# Altium project foxbms2-master.PrjPcb (part 3 of 7)

## Sheet mcu-com-gpio-tim.SchDoc
size A3; DocumentNumber: 24; SheetNumber: 24; SheetTotal: 45; SheetDescription: MCU COM, GPIO and TIM
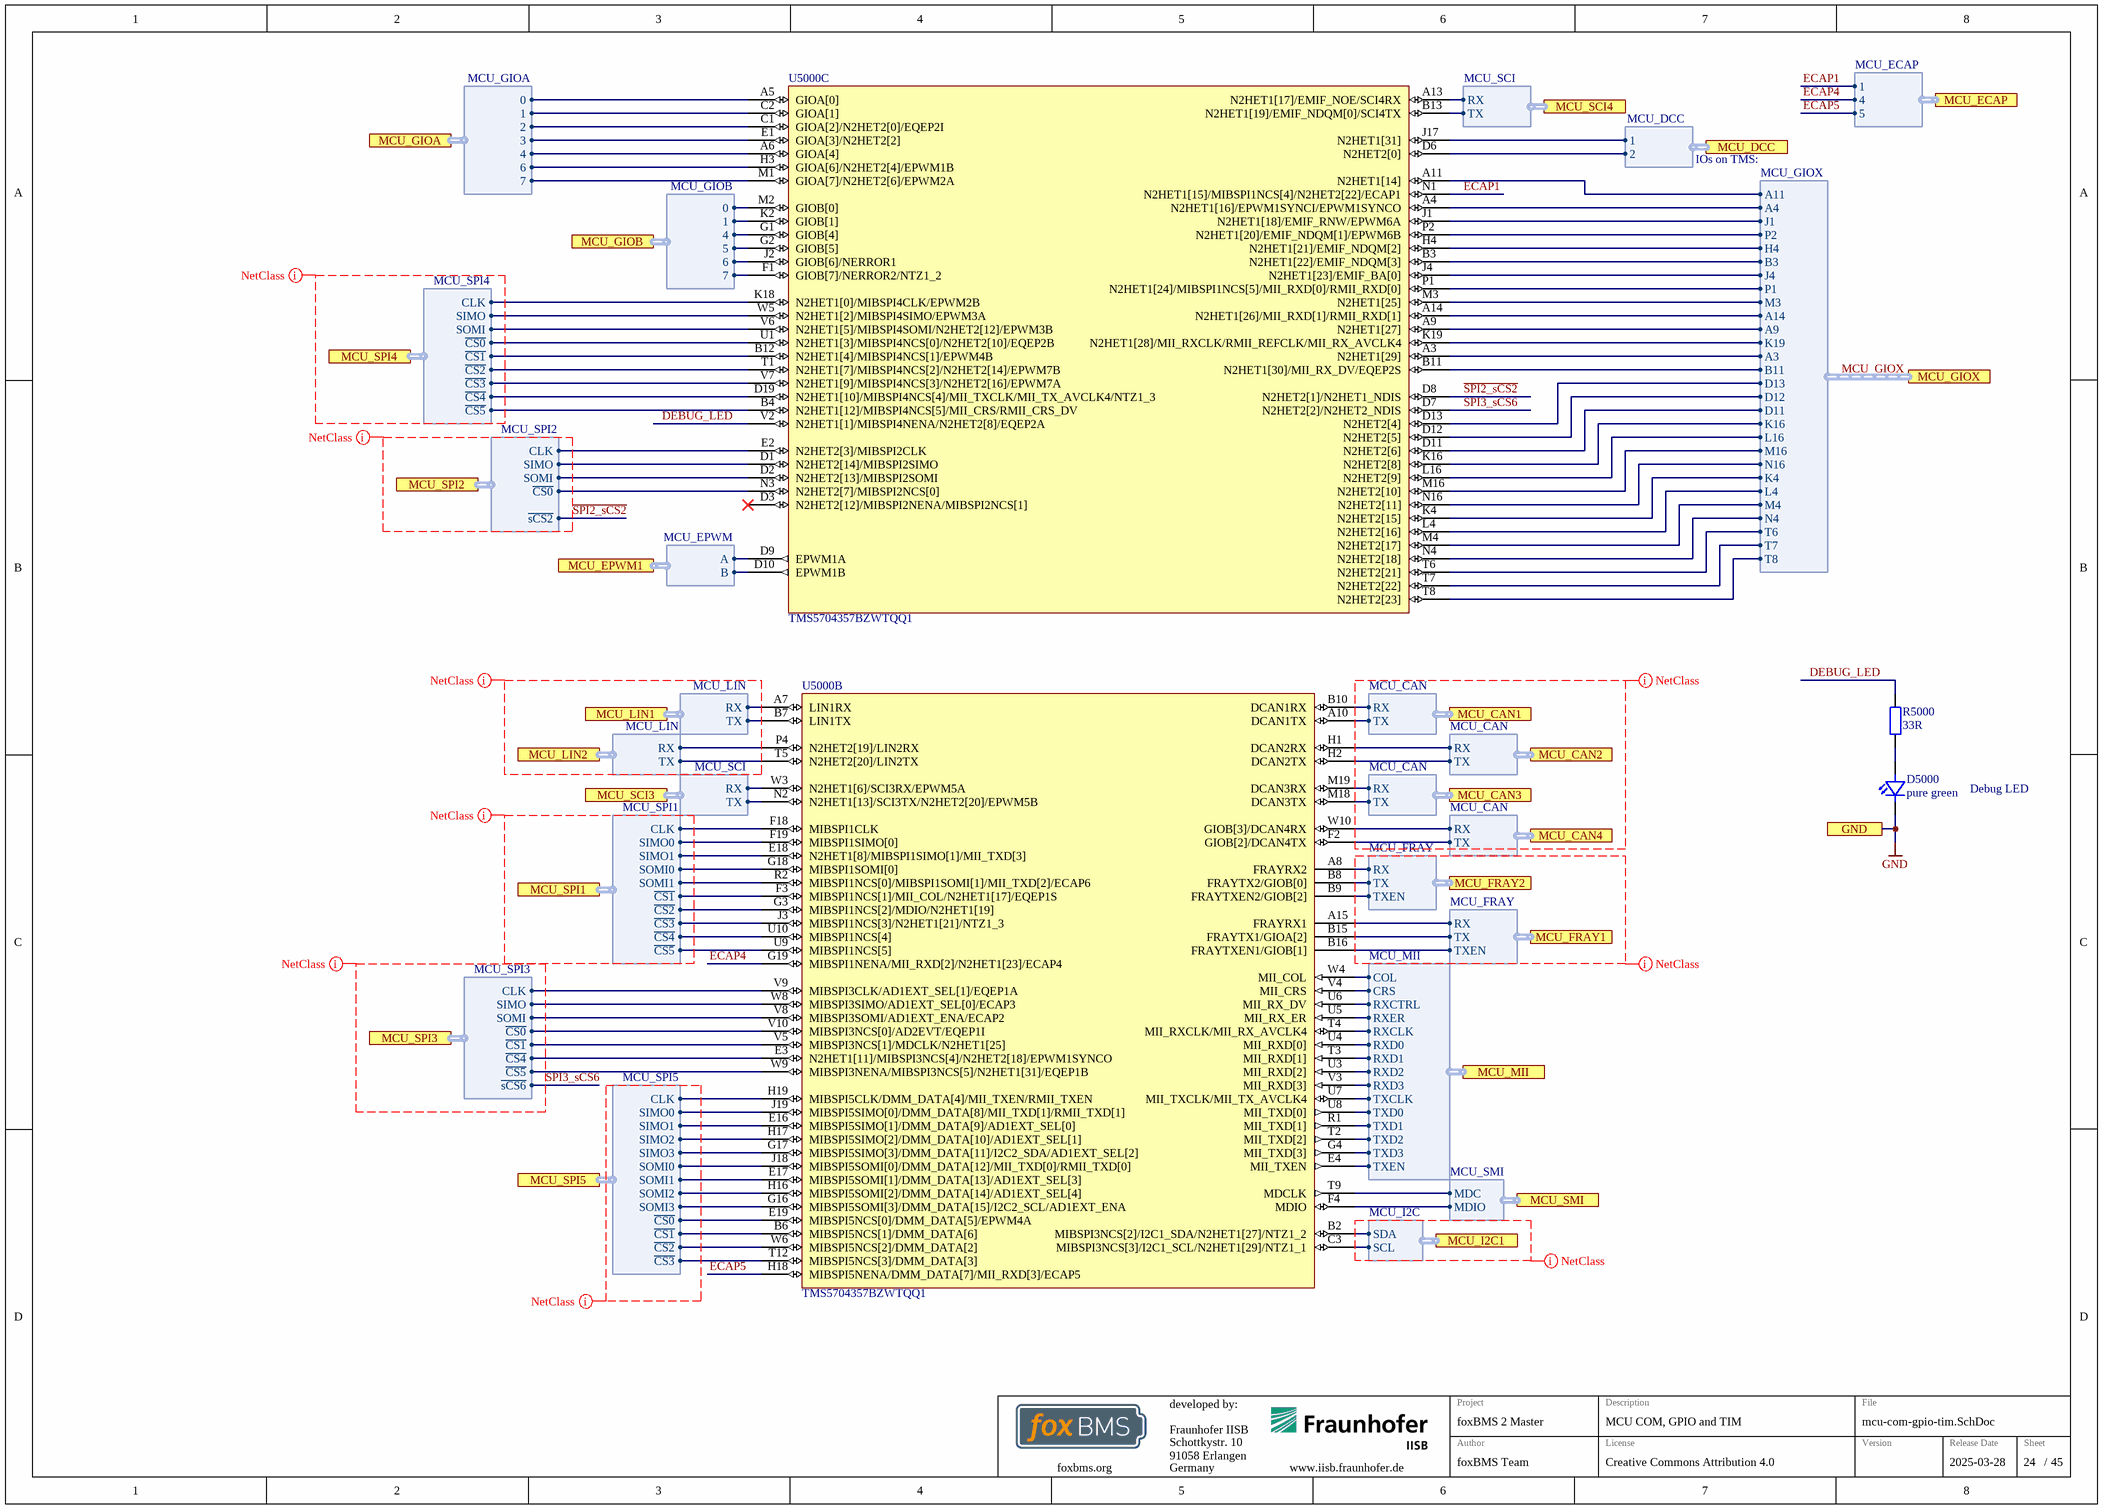
[diagram p7: mcu-com-gpio-tim.SchDoc]

### Parts
D5000  pure green  [LEDC1608X07N]
R5000  33R  [RESC1005X04N]
U5000  TMS5704357BZWTQQ1  [BGA337C80P19X19_1600X1600X140]  (parts B,C of 6)

### Ports
GND, MCU_CAN1 (harness MCU_CAN), MCU_CAN2 (harness MCU_CAN), MCU_CAN3 (harness MCU_CAN), MCU_CAN4 (harness MCU_CAN), MCU_DCC (harness MCU_DCC), MCU_ECAP (harness MCU_ECAP), MCU_EPWM1 (harness MCU_EPWM), MCU_FRAY1 (harness MCU_FRAY), MCU_FRAY2 (harness MCU_FRAY), MCU_GIOA (harness MCU_GIOA), MCU_GIOB (harness MCU_GIOB), MCU_GIOX (harness MCU_GIOX), MCU_I2C1 (harness MCU_I2C), MCU_LIN1 (harness MCU_LIN), MCU_LIN2 (harness MCU_LIN), MCU_MII (harness MCU_MII), MCU_SCI3 (harness MCU_SCI), MCU_SCI4 (harness MCU_SCI), MCU_SMI (harness MCU_SMI), MCU_SPI1 (harness MCU_SPI1), MCU_SPI2 (harness MCU_SPI2), MCU_SPI3 (harness MCU_SPI3), MCU_SPI4 (harness MCU_SPI4), MCU_SPI5 (harness MCU_SPI5)

### Harnesses
MCU_CAN: RX, TX
MCU_FRAY: RX, TX, TXEN
MCU_SMI: MDC, MDIO
MCU_MII: TXD0, TXD1, TXD2, TXD3, TXEN, TXCLK, RXCTRL, RXCLK, RXD3, RXD2, RXD0, RXD1, RXER, COL, CRS
MCU_LIN: RX, TX
MCU_SPI1: CLK, SIMO0, SOMI0, SOMI1, ~{CS1}, ~{CS2}, ~{CS3}, ~{CS4}, ~{CS5}, SIMO1
MCU_SPI3: CLK, SIMO, SOMI, ~{CS1}, ~{CS4}, ~{CS5}, ~{CS0}, ~{sCS6}
MCU_SPI5: CLK, SIMO0, SOMI0, SOMI1, ~{CS1}, ~{CS2}, ~{CS3}, ~{CS0}, SIMO1, SIMO2, SIMO3, SOMI2, SOMI3
MCU_SCI: RX, TX
MCU_I2C: SDA, SCL
MCU_SPI4: CLK, SIMO, SOMI, ~{CS1}, ~{CS2}, ~{CS3}, ~{CS0}, ~{CS4}, ~{CS5}
MCU_SPI2: CLK, SIMO, SOMI, ~{CS0}, ~{sCS2}
MCU_EPWM: A, B
MCU_GIOA: 0, 2, 3, 4, 6, 7, 1
MCU_GIOB: 0, 1, 4, 5, 6, 7
MCU_DCC: 1, 2
MCU_ECAP: 1, 4, 5
MCU_GIOX: A11, A4, J1, P2, H4, B3, J4, P1, M3, A14, A9, K19, A3, B11, D13, D12, D11, K16, L16, M16, N16, K4, L4, M4, T6, T7, N4, T8

### Nets
GND: D5000.1(C) ; port GND
~{SPI2_sCS2}: U5000.D8(N2HET2[1]/N2HET1_NDIS) ; port MCU_SPI2.~{sCS2}  [project net MCU_SPI2~{.}sCS2]
~{SPI3_sCS6}: U5000.D7(N2HET2[2]/N2HET2_NDIS) ; port MCU_SPI3.~{sCS6}  [project net MCU_SPI3~{.}sCS6]
CAN1-CTRL~{.}STB: U5000.T8(N2HET2[23]) ; port MCU_GIOX.T8
CAN1-CTRL.EN: U5000.N4(N2HET2[18]) ; port MCU_GIOX.N4
COM_IO~{.}ETH_INT: U5000.J2(GIOB[6]/NERROR1) ; port MCU_GIOB.6
COM_IO~{.}ETH_RESET: U5000.C2(GIOA[1]) ; port MCU_GIOA.1
COM_IO.CAN_FAULT: U5000.G2(GIOB[5]) ; port MCU_GIOB.5
DEBUG_LED: R5000.2 U5000.V2(N2HET1[1]/MIBSPI4NENA/N2HET2[8]/EQEP2A)  [project net DEBUG_LED_24]
ECAP1: U5000.N1(N2HET1[15]/MIBSPI1NCS[4]/N2HET2[22]/ECAP1) ; port MCU_ECAP.1  [project net IODEV_IO.IM_PWM]
ECAP4: U5000.G19(MIBSPI1NENA/MII_RXD[2]/N2HET1[23]/ECAP4) ; port MCU_ECAP.4  [project net EXT_CON.ECAP4]
ECAP5: U5000.H18(MIBSPI5NENA/DMM_DATA[7]/MII_RXD[3]/ECAP5) ; port MCU_ECAP.5  [project net EXT_CON.ECAP5]
EXT_CON.DCC1: U5000.J17(N2HET1[31]) ; port MCU_DCC.1
EXT_CON.EPWM1A: U5000.D9(EPWM1A) ; port MCU_EPWM1.A
EXT_CON.EPWM1B: U5000.D10(EPWM1B) ; port MCU_EPWM1.B
EXT_CON.IL_STATE: U5000.A3(N2HET1[29]) ; port MCU_GIOX.A3
EXT_CON.MCU_A4: U5000.A4(N2HET1[16]/EPWM1SYNCI/EPWM1SYNCO) ; port MCU_GIOX.A4
EXT_CON.MCU_A11: U5000.A11(N2HET1[14]) ; port MCU_GIOX.A11
EXT_CON.MCU_A14: U5000.A14(N2HET1[26]/MII_RXD[1]/RMII_RXD[1]) ; port MCU_GIOX.A14
EXT_CON.MCU_B3: U5000.B3(N2HET1[22]/EMIF_NDQM[3]) ; port MCU_GIOX.B3
EXT_CON.MCU_GIOA7: U5000.M1(GIOA[7]/N2HET2[6]/EPWM2A) ; port MCU_GIOA.7
EXT_CON.MCU_H4: U5000.H4(N2HET1[21]/EMIF_NDQM[2]) ; port MCU_GIOX.H4
EXT_CON.MCU_J1: U5000.J1(N2HET1[18]/EMIF_RNW/EPWM6A) ; port MCU_GIOX.J1
EXT_CON.MCU_J4: U5000.J4(N2HET1[23]/EMIF_BA[0]) ; port MCU_GIOX.J4
EXT_CON.MCU_K19: U5000.K19(N2HET1[28]/MII_RXCLK/RMII_REFCLK/MII_RX_AVCLK4) ; port MCU_GIOX.K19
EXT_CON.MCU_M16: U5000.M16(N2HET2[10]) ; port MCU_GIOX.M16
EXT_CON.MCU_N16: U5000.N16(N2HET2[11]) ; port MCU_GIOX.N16
EXT_CON.MCU_P1: U5000.P1(N2HET1[24]/MIBSPI1NCS[5]/MII_RXD[0]/RMII_RXD[0]) ; port MCU_GIOX.P1
EXT_CON.MCU_P2: U5000.P2(N2HET1[20]/EMIF_NDQM[1]/EPWM6B) ; port MCU_GIOX.P2
FLASH_SPI~{.}CS: U5000.V10(MIBSPI3NCS[0]/AD2EVT/EQEP1I) ; port MCU_SPI3.~{CS0}
FLASH_SPI.CLK: U5000.V9(MIBSPI3CLK/AD1EXT_SEL[1]/EQEP1A) ; port MCU_SPI3.CLK
FLASH_SPI.MISO: U5000.V8(MIBSPI3SOMI/AD1EXT_ENA/ECAP2) ; port MCU_SPI3.SOMI
FLASH_SPI.MOSI: U5000.W8(MIBSPI3SIMO/AD1EXT_SEL[0]/ECAP3) ; port MCU_SPI3.SIMO
FRAM_SPI~{.}CS: U5000.V5(MIBSPI3NCS[1]/MDCLK/N2HET1[25]) ; port MCU_SPI3.~{CS1}
IF_CON~{.}IF_INT0: U5000.C1(GIOA[2]/N2HET2[0]/EQEP2I) ; port MCU_GIOA.2
IF_CON~{.}IF_INT1: U5000.E1(GIOA[3]/N2HET2[2]) ; port MCU_GIOA.3
IF_CON~{.}IF_INT2: U5000.A6(GIOA[4]) ; port MCU_GIOA.4
IF_CON~{.}IF_INT3: U5000.H3(GIOA[6]/N2HET2[4]/EPWM1B) ; port MCU_GIOA.6
INTERLOCK_IO.IL_HS_ENABLE: U5000.B11(N2HET1[30]/MII_RX_DV/EQEP2S) ; port MCU_GIOX.B11
IODEV_IO~{.}SMSW_FAULT: U5000.M2(GIOB[0]) ; port MCU_GIOB.0
IODEV_IO~{.}SMSW_RESET: U5000.L4(N2HET2[16]) ; port MCU_GIOX.L4
IODEV_IO.CONT_FB_EN: U5000.L16(N2HET2[9]) ; port MCU_GIOX.L16
IODEV_IO.IM_OK: U5000.A9(N2HET1[27]) ; port MCU_GIOX.A9
IODEV_IO.IM_SUP_EN: U5000.M3(N2HET1[25]) ; port MCU_GIOX.M3
MCU_CAN1.RX: U5000.B10(DCAN1RX) ; port MCU_CAN1.RX
MCU_CAN1.TX: U5000.A10(DCAN1TX) ; port MCU_CAN1.TX
MCU_CAN2.RX: U5000.H1(DCAN2RX) ; port MCU_CAN2.RX
MCU_CAN2.TX: U5000.H2(DCAN2TX) ; port MCU_CAN2.TX
MCU_CAN3.RX: U5000.M19(DCAN3RX) ; port MCU_CAN3.RX
MCU_CAN3.TX: U5000.M18(DCAN3TX) ; port MCU_CAN3.TX
MCU_CAN4.RX: U5000.W10(GIOB[3]/DCAN4RX) ; port MCU_CAN4.RX
MCU_CAN4.TX: U5000.F2(GIOB[2]/DCAN4TX) ; port MCU_CAN4.TX
MCU_DCC.2: U5000.D6(N2HET2[0]) ; port MCU_DCC.2
MCU_FRAY1.RX: U5000.A15(FRAYRX1) ; port MCU_FRAY1.RX
MCU_FRAY1.TX: U5000.B15(FRAYTX1/GIOA[2]) ; port MCU_FRAY1.TX
MCU_FRAY1.TXEN: U5000.B16(FRAYTXEN1/GIOB[1]) ; port MCU_FRAY1.TXEN
MCU_FRAY2.RX: U5000.A8(FRAYRX2) ; port MCU_FRAY2.RX
MCU_FRAY2.TX: U5000.B8(FRAYTX2/GIOB[0]) ; port MCU_FRAY2.TX
MCU_FRAY2.TXEN: U5000.B9(FRAYTXEN2/GIOB[2]) ; port MCU_FRAY2.TXEN
MCU_GIOA.0: U5000.A5(GIOA[0]) ; port MCU_GIOA.0
MCU_GIOB.1: U5000.K2(GIOB[1]) ; port MCU_GIOB.1
MCU_GIOB.4: U5000.G1(GIOB[4]) ; port MCU_GIOB.4
MCU_GIOB.7: U5000.F1(GIOB[7]/NERROR2/NTZ1_2) ; port MCU_GIOB.7
MCU_GIOX.D11: U5000.D11(N2HET2[6]) ; port MCU_GIOX.D11
MCU_GIOX.D12: U5000.D12(N2HET2[5]) ; port MCU_GIOX.D12
MCU_GIOX.D13: U5000.D13(N2HET2[4]) ; port MCU_GIOX.D13
MCU_GIOX.K4: U5000.K4(N2HET2[15]) ; port MCU_GIOX.K4
MCU_GIOX.K16: U5000.K16(N2HET2[8]) ; port MCU_GIOX.K16
MCU_GIOX.M4: U5000.M4(N2HET2[17]) ; port MCU_GIOX.M4
MCU_GIOX.T6: U5000.T6(N2HET2[21]) ; port MCU_GIOX.T6
MCU_GIOX.T7: U5000.T7(N2HET2[22]) ; port MCU_GIOX.T7
MCU_I2C1.SCL: U5000.C3(MIBSPI3NCS[3]/I2C1_SCL/N2HET1[29]/NTZ1_1) ; port MCU_I2C1.SCL
MCU_I2C1.SDA: U5000.B2(MIBSPI3NCS[2]/I2C1_SDA/N2HET1[27]/NTZ1_2) ; port MCU_I2C1.SDA
MCU_LIN1.RX: U5000.A7(LIN1RX) ; port MCU_LIN1.RX
MCU_LIN1.TX: U5000.B7(LIN1TX) ; port MCU_LIN1.TX
MCU_LIN2.RX: U5000.P4(N2HET2[19]/LIN2RX) ; port MCU_LIN2.RX
MCU_LIN2.TX: U5000.T5(N2HET2[20]/LIN2TX) ; port MCU_LIN2.TX
MCU_MII.COL: U5000.W4(MII_COL) ; port MCU_MII.COL
MCU_MII.CRS: U5000.V4(MII_CRS) ; port MCU_MII.CRS
MCU_MII.RXCLK: U5000.T4(MII_RXCLK/MII_RX_AVCLK4) ; port MCU_MII.RXCLK
MCU_MII.RXCTRL: U5000.U6(MII_RX_DV) ; port MCU_MII.RXCTRL
MCU_MII.RXD0: U5000.U4(MII_RXD[0]) ; port MCU_MII.RXD0
MCU_MII.RXD1: U5000.T3(MII_RXD[1]) ; port MCU_MII.RXD1
MCU_MII.RXD2: U5000.U3(MII_RXD[2]) ; port MCU_MII.RXD2
MCU_MII.RXD3: U5000.V3(MII_RXD[3]) ; port MCU_MII.RXD3
MCU_MII.RXER: U5000.U5(MII_RX_ER) ; port MCU_MII.RXER
MCU_MII.TXCLK: U5000.U7(MII_TXCLK/MII_TX_AVCLK4) ; port MCU_MII.TXCLK
MCU_MII.TXD0: U5000.U8(MII_TXD[0]) ; port MCU_MII.TXD0
MCU_MII.TXD1: U5000.R1(MII_TXD[1]) ; port MCU_MII.TXD1
MCU_MII.TXD2: U5000.T2(MII_TXD[2]) ; port MCU_MII.TXD2
MCU_MII.TXD3: U5000.G4(MII_TXD[3]) ; port MCU_MII.TXD3
MCU_MII.TXEN: U5000.E4(MII_TXEN) ; port MCU_MII.TXEN
MCU_SCI3.RX: U5000.W3(N2HET1[6]/SCI3RX/EPWM5A) ; port MCU_SCI3.RX
MCU_SCI3.TX: U5000.N2(N2HET1[13]/SCI3TX/N2HET2[20]/EPWM5B) ; port MCU_SCI3.TX
MCU_SCI4.RX: U5000.A13(N2HET1[17]/EMIF_NOE/SCI4RX) ; port MCU_SCI4.RX
MCU_SCI4.TX: U5000.B13(N2HET1[19]/EMIF_NDQM[0]/SCI4TX) ; port MCU_SCI4.TX
MCU_SMI.MDC: U5000.T9(MDCLK) ; port MCU_SMI.MDC
MCU_SMI.MDIO: U5000.F4(MDIO) ; port MCU_SMI.MDIO
MCU_SPI1~{.}CS1: U5000.F3(MIBSPI1NCS[1]/MII_COL/N2HET1[17]/EQEP1S) ; port MCU_SPI1.~{CS1}
MCU_SPI1~{.}CS2: U5000.G3(MIBSPI1NCS[2]/MDIO/N2HET1[19]) ; port MCU_SPI1.~{CS2}
MCU_SPI1~{.}CS3: U5000.J3(MIBSPI1NCS[3]/N2HET1[21]/NTZ1_3) ; port MCU_SPI1.~{CS3}
MCU_SPI1~{.}CS4: U5000.U10(MIBSPI1NCS[4]) ; port MCU_SPI1.~{CS4}
MCU_SPI1~{.}CS5: U5000.U9(MIBSPI1NCS[5]) ; port MCU_SPI1.~{CS5}
MCU_SPI1.CLK: U5000.F18(MIBSPI1CLK) ; port MCU_SPI1.CLK
MCU_SPI1.SIMO0: U5000.F19(MIBSPI1SIMO[0]) ; port MCU_SPI1.SIMO0
MCU_SPI1.SIMO1: U5000.E18(N2HET1[8]/MIBSPI1SIMO[1]/MII_TXD[3]) ; port MCU_SPI1.SIMO1
MCU_SPI1.SOMI0: U5000.G18(MIBSPI1SOMI[0]) ; port MCU_SPI1.SOMI0
MCU_SPI1.SOMI1: U5000.R2(MIBSPI1NCS[0]/MIBSPI1SOMI[1]/MII_TXD[2]/ECAP6) ; port MCU_SPI1.SOMI1
MCU_SPI2~{.}CS0: U5000.N3(N2HET2[7]/MIBSPI2NCS[0]) ; port MCU_SPI2.~{CS0}
MCU_SPI2.CLK: U5000.E2(N2HET2[3]/MIBSPI2CLK) ; port MCU_SPI2.CLK
MCU_SPI2.SIMO: U5000.D1(N2HET2[14]/MIBSPI2SIMO) ; port MCU_SPI2.SIMO
MCU_SPI2.SOMI: U5000.D2(N2HET2[13]/MIBSPI2SOMI) ; port MCU_SPI2.SOMI
MCU_SPI3~{.}CS4: U5000.E3(N2HET1[11]/MIBSPI3NCS[4]/N2HET2[18]/EPWM1SYNCO) ; port MCU_SPI3.~{CS4}
MCU_SPI3~{.}CS5: U5000.W9(MIBSPI3NENA/MIBSPI3NCS[5]/N2HET1[31]/EQEP1B) ; port MCU_SPI3.~{CS5}
MCU_SPI4~{.}CS0: U5000.U1(N2HET1[3]/MIBSPI4NCS[0]/N2HET2[10]/EQEP2B) ; port MCU_SPI4.~{CS0}
MCU_SPI4~{.}CS1: U5000.B12(N2HET1[4]/MIBSPI4NCS[1]/EPWM4B) ; port MCU_SPI4.~{CS1}
MCU_SPI4~{.}CS2: U5000.T1(N2HET1[7]/MIBSPI4NCS[2]/N2HET2[14]/EPWM7B) ; port MCU_SPI4.~{CS2}
MCU_SPI4~{.}CS3: U5000.V7(N2HET1[9]/MIBSPI4NCS[3]/N2HET2[16]/EPWM7A) ; port MCU_SPI4.~{CS3}
MCU_SPI4~{.}CS4: U5000.D19(N2HET1[10]/MIBSPI4NCS[4]/MII_TXCLK/MII_TX_AVCLK4/NTZ1_3) ; port MCU_SPI4.~{CS4}
MCU_SPI4~{.}CS5: U5000.B4(N2HET1[12]/MIBSPI4NCS[5]/MII_CRS/RMII_CRS_DV) ; port MCU_SPI4.~{CS5}
MCU_SPI4.CLK: U5000.K18(N2HET1[0]/MIBSPI4CLK/EPWM2B) ; port MCU_SPI4.CLK
MCU_SPI4.SIMO: U5000.W5(N2HET1[2]/MIBSPI4SIMO/EPWM3A) ; port MCU_SPI4.SIMO
MCU_SPI4.SOMI: U5000.V6(N2HET1[5]/MIBSPI4SOMI/N2HET2[12]/EPWM3B) ; port MCU_SPI4.SOMI
MCU_SPI5~{.}CS0: U5000.E19(MIBSPI5NCS[0]/DMM_DATA[5]/EPWM4A) ; port MCU_SPI5.~{CS0}
MCU_SPI5~{.}CS1: U5000.B6(MIBSPI5NCS[1]/DMM_DATA[6]) ; port MCU_SPI5.~{CS1}
MCU_SPI5~{.}CS2: U5000.W6(MIBSPI5NCS[2]/DMM_DATA[2]) ; port MCU_SPI5.~{CS2}
MCU_SPI5~{.}CS3: U5000.T12(MIBSPI5NCS[3]/DMM_DATA[3]) ; port MCU_SPI5.~{CS3}
MCU_SPI5.CLK: U5000.H19(MIBSPI5CLK/DMM_DATA[4]/MII_TXEN/RMII_TXEN) ; port MCU_SPI5.CLK
MCU_SPI5.SIMO0: U5000.J19(MIBSPI5SIMO[0]/DMM_DATA[8]/MII_TXD[1]/RMII_TXD[1]) ; port MCU_SPI5.SIMO0
MCU_SPI5.SIMO1: U5000.E16(MIBSPI5SIMO[1]/DMM_DATA[9]/AD1EXT_SEL[0]) ; port MCU_SPI5.SIMO1
MCU_SPI5.SIMO2: U5000.H17(MIBSPI5SIMO[2]/DMM_DATA[10]/AD1EXT_SEL[1]) ; port MCU_SPI5.SIMO2
MCU_SPI5.SIMO3: U5000.G17(MIBSPI5SIMO[3]/DMM_DATA[11]/I2C2_SDA/AD1EXT_SEL[2]) ; port MCU_SPI5.SIMO3
MCU_SPI5.SOMI0: U5000.J18(MIBSPI5SOMI[0]/DMM_DATA[12]/MII_TXD[0]/RMII_TXD[0]) ; port MCU_SPI5.SOMI0
MCU_SPI5.SOMI1: U5000.E17(MIBSPI5SOMI[1]/DMM_DATA[13]/AD1EXT_SEL[3]) ; port MCU_SPI5.SOMI1
MCU_SPI5.SOMI2: U5000.H16(MIBSPI5SOMI[2]/DMM_DATA[14]/AD1EXT_SEL[4]) ; port MCU_SPI5.SOMI2
MCU_SPI5.SOMI3: U5000.G16(MIBSPI5SOMI[3]/DMM_DATA[15]/I2C2_SCL/AD1EXT_ENA) ; port MCU_SPI5.SOMI3
NetD5000_2: D5000.2(A) R5000.1

Not connected (* = marked no-connect by the designer): U5000 D3(N2HET2[12]/MIBSPI2NENA/MIBSPI2NCS[1])*

### Buses and harness runs
harness MCU_GIOX = port MCU_GIOX

### Layout directives
net class MCU_CAN: (no net found under the mark)
net class MCU_FRAY: (no net found under the mark)
net class MCU_SPI1: (no net found under the mark)
net class MCU_SPI3: ~{SPI3_sCS6}
net class MCU_SPI5: (no net found under the mark)
net class MCU_SPI2: ~{SPI2_sCS2}
net class MCU_SPI4: (no net found under the mark)
net class MCU_LIN: (no net found under the mark)
net class MCU_I2C: (no net found under the mark)

### Notes on the sheet
- standard IOs on TMS:
- Debug LED
- Fraunhofer IISB
- Schottkystr. 10
- developed by:
- 91058 Erlangen
- Germany
- Author
- Project
- License
- Description
- File
- Version
- Release Date
- Sheet
- foxbms.org <https://foxbms.org>
- www.iisb.fraunhofer.de <https://www.iisb.fraunhofer.de/>
- foxBMS Team
- /

### Library data of the parts
D5000 = LED_0603_pure_green_AECQ: TLMP1100-GS08; Manufacturer: Vishay; Breakdown Voltage: 5V; Continuous Forward Current: 20mA; Forward Voltage @ 20mA: 2.1V; Automotive Qualified: True; Part Number: LED_0603_pure_green_AECQ; Color: pure green; Operating Temperature: -40°C - 100°C; ComponentLink1Description: Datasheet; ComponentLink1URL: http://www.farnell.com/datasheets/2049164.pdf; Supplier 1: Farnell; Supplier Part Number 1: 1328306; Supplier 2: Digikey; Supplier Part Number 2: 751-1176-1-ND; PnP Package: LED_0603
R5000 = gen_R_33R_0402: SMD Resistor 33R 0402; Tolerance: 1%; Power: 0.063W; Case EIA: 0402; Case Metric: 1005; Maximum Working Voltage: 50V; PnP Package: 0402R; Automotive Qualified: True; AEC-Q Grade: Grade 0; AEC-Q Norm: AEC-Q200; Part Number: gen_R_33R_0402; Operating Temperature: -55°C - +155°C; Resistance: 33R; Series: E24; PnP Value: 33R; ECCN: EAR99; Supplier 1: Digikey; Supplier Part Number 1: A129609CT-ND

## Sheet mcu-emif-etm-dmm.SchDoc
size A3; DocumentNumber: 25; SheetNumber: 25; SheetTotal: 45; SheetDescription: MCU EMIF, ETM and DMM
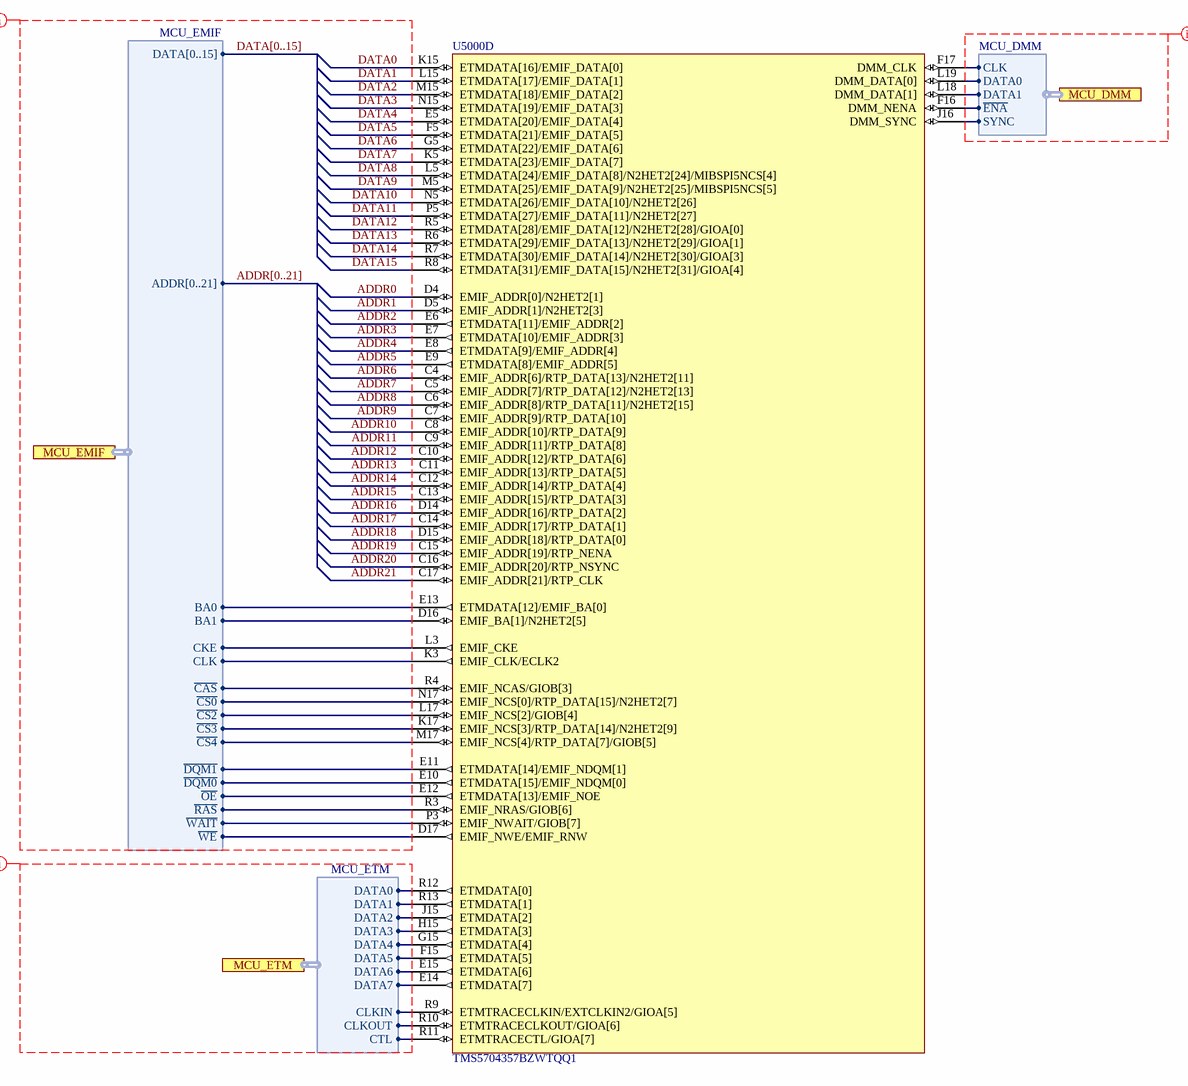
[diagram p8: mcu-emif-etm-dmm.SchDoc]

### Parts
U5000  TMS5704357BZWTQQ1  [BGA337C80P19X19_1600X1600X140]  (part D of 6)

### Ports
MCU_DMM (harness MCU_DMM), MCU_EMIF (harness MCU_EMIF), MCU_ETM (harness MCU_ETM)

### Harnesses
MCU_ETM: CLKOUT, CTL, CLKIN, DATA0, DATA1, DATA2, DATA3, DATA4, DATA5, DATA6, DATA7
MCU_DMM: CLK, DATA0, DATA1, SYNC, ~{ENA}
MCU_EMIF: DATA[0..15], ADDR[0..21], BA0, BA1, CKE, CLK, ~{CAS}, ~{CS0}, ~{CS2}, ~{CS3}, ~{CS4}, ~{DQM1}, ~{DQM0}, ~{OE}, ~{RAS}, ~{WAIT}, ~{WE}

### Nets
ADDR0: U5000.D4(EMIF_ADDR[0]/N2HET2[1])
ADDR1: U5000.D5(EMIF_ADDR[1]/N2HET2[3])
ADDR2: U5000.E6(ETMDATA[11]/EMIF_ADDR[2])
ADDR3: U5000.E7(ETMDATA[10]/EMIF_ADDR[3])
ADDR4: U5000.E8(ETMDATA[9]/EMIF_ADDR[4])
ADDR5: U5000.E9(ETMDATA[8]/EMIF_ADDR[5])
ADDR6: U5000.C4(EMIF_ADDR[6]/RTP_DATA[13]/N2HET2[11])
ADDR7: U5000.C5(EMIF_ADDR[7]/RTP_DATA[12]/N2HET2[13])
ADDR8: U5000.C6(EMIF_ADDR[8]/RTP_DATA[11]/N2HET2[15])
ADDR9: U5000.C7(EMIF_ADDR[9]/RTP_DATA[10])
ADDR10: U5000.C8(EMIF_ADDR[10]/RTP_DATA[9])
ADDR11: U5000.C9(EMIF_ADDR[11]/RTP_DATA[8])
ADDR12: U5000.C10(EMIF_ADDR[12]/RTP_DATA[6])
ADDR13: U5000.C11(EMIF_ADDR[13]/RTP_DATA[5])
ADDR14: U5000.C12(EMIF_ADDR[14]/RTP_DATA[4])
ADDR15: U5000.C13(EMIF_ADDR[15]/RTP_DATA[3])
ADDR16: U5000.D14(EMIF_ADDR[16]/RTP_DATA[2])
ADDR17: U5000.C14(EMIF_ADDR[17]/RTP_DATA[1])
ADDR18: U5000.D15(EMIF_ADDR[18]/RTP_DATA[0])
ADDR19: U5000.C15(EMIF_ADDR[19]/RTP_NENA)
ADDR20: U5000.C16(EMIF_ADDR[20]/RTP_NSYNC)
ADDR21: U5000.C17(EMIF_ADDR[21]/RTP_CLK)
DATA0: U5000.K15(ETMDATA[16]/EMIF_DATA[0])
DATA1: U5000.L15(ETMDATA[17]/EMIF_DATA[1])
DATA2: U5000.M15(ETMDATA[18]/EMIF_DATA[2])
DATA3: U5000.N15(ETMDATA[19]/EMIF_DATA[3])
DATA4: U5000.E5(ETMDATA[20]/EMIF_DATA[4])
DATA5: U5000.F5(ETMDATA[21]/EMIF_DATA[5])
DATA6: U5000.G5(ETMDATA[22]/EMIF_DATA[6])
DATA7: U5000.K5(ETMDATA[23]/EMIF_DATA[7])
DATA8: U5000.L5(ETMDATA[24]/EMIF_DATA[8]/N2HET2[24]/MIBSPI5NCS[4])
DATA9: U5000.M5(ETMDATA[25]/EMIF_DATA[9]/N2HET2[25]/MIBSPI5NCS[5])
DATA10: U5000.N5(ETMDATA[26]/EMIF_DATA[10]/N2HET2[26])
DATA11: U5000.P5(ETMDATA[27]/EMIF_DATA[11]/N2HET2[27])
DATA12: U5000.R5(ETMDATA[28]/EMIF_DATA[12]/N2HET2[28]/GIOA[0])
DATA13: U5000.R6(ETMDATA[29]/EMIF_DATA[13]/N2HET2[29]/GIOA[1])
DATA14: U5000.R7(ETMDATA[30]/EMIF_DATA[14]/N2HET2[30]/GIOA[3])
DATA15: U5000.R8(ETMDATA[31]/EMIF_DATA[15]/N2HET2[31]/GIOA[4])
MCU_DMM~{.}ENA: U5000.F16(DMM_NENA) ; port MCU_DMM.~{ENA}
MCU_DMM.CLK: U5000.F17(DMM_CLK) ; port MCU_DMM.CLK
MCU_DMM.DATA0: U5000.L19(DMM_DATA[0]) ; port MCU_DMM.DATA0
MCU_DMM.DATA1: U5000.L18(DMM_DATA[1]) ; port MCU_DMM.DATA1
MCU_DMM.SYNC: U5000.J16(DMM_SYNC) ; port MCU_DMM.SYNC
MCU_EMIF~{.}CAS: U5000.R4(EMIF_NCAS/GIOB[3]) ; port MCU_EMIF.~{CAS}
MCU_EMIF~{.}CS0: U5000.N17(EMIF_NCS[0]/RTP_DATA[15]/N2HET2[7]) ; port MCU_EMIF.~{CS0}
MCU_EMIF~{.}CS2: U5000.L17(EMIF_NCS[2]/GIOB[4]) ; port MCU_EMIF.~{CS2}
MCU_EMIF~{.}CS3: U5000.K17(EMIF_NCS[3]/RTP_DATA[14]/N2HET2[9]) ; port MCU_EMIF.~{CS3}
MCU_EMIF~{.}CS4: U5000.M17(EMIF_NCS[4]/RTP_DATA[7]/GIOB[5]) ; port MCU_EMIF.~{CS4}
MCU_EMIF~{.}DQM0: U5000.E10(ETMDATA[15]/EMIF_NDQM[0]) ; port MCU_EMIF.~{DQM0}
MCU_EMIF~{.}DQM1: U5000.E11(ETMDATA[14]/EMIF_NDQM[1]) ; port MCU_EMIF.~{DQM1}
MCU_EMIF~{.}OE: U5000.E12(ETMDATA[13]/EMIF_NOE) ; port MCU_EMIF.~{OE}
MCU_EMIF~{.}RAS: U5000.R3(EMIF_NRAS/GIOB[6]) ; port MCU_EMIF.~{RAS}
MCU_EMIF~{.}WAIT: U5000.P3(EMIF_NWAIT/GIOB[7]) ; port MCU_EMIF.~{WAIT}
MCU_EMIF~{.}WE: U5000.D17(EMIF_NWE/EMIF_RNW) ; port MCU_EMIF.~{WE}
MCU_EMIF.BA0: U5000.E13(ETMDATA[12]/EMIF_BA[0]) ; port MCU_EMIF.BA0
MCU_EMIF.BA1: U5000.D16(EMIF_BA[1]/N2HET2[5]) ; port MCU_EMIF.BA1
MCU_EMIF.CKE: U5000.L3(EMIF_CKE) ; port MCU_EMIF.CKE
MCU_EMIF.CLK: U5000.K3(EMIF_CLK/ECLK2) ; port MCU_EMIF.CLK
MCU_ETM.CLKIN: U5000.R9(ETMTRACECLKIN/EXTCLKIN2/GIOA[5]) ; port MCU_ETM.CLKIN
MCU_ETM.CLKOUT: U5000.R10(ETMTRACECLKOUT/GIOA[6]) ; port MCU_ETM.CLKOUT
MCU_ETM.CTL: U5000.R11(ETMTRACECTL/GIOA[7]) ; port MCU_ETM.CTL
MCU_ETM.DATA0: U5000.R12(ETMDATA[0]) ; port MCU_ETM.DATA0
MCU_ETM.DATA1: U5000.R13(ETMDATA[1]) ; port MCU_ETM.DATA1
MCU_ETM.DATA2: U5000.J15(ETMDATA[2]) ; port MCU_ETM.DATA2
MCU_ETM.DATA3: U5000.H15(ETMDATA[3]) ; port MCU_ETM.DATA3
MCU_ETM.DATA4: U5000.G15(ETMDATA[4]) ; port MCU_ETM.DATA4
MCU_ETM.DATA5: U5000.F15(ETMDATA[5]) ; port MCU_ETM.DATA5
MCU_ETM.DATA6: U5000.E15(ETMDATA[6]) ; port MCU_ETM.DATA6
MCU_ETM.DATA7: U5000.E14(ETMDATA[7]) ; port MCU_ETM.DATA7

### Buses and harness runs
bus ADDR[0..21]
bus DATA[0..15]

### Layout directives
net class MCU_EMIF: ADDR0, ADDR1, ADDR2, ADDR3, ADDR4, ADDR5, ADDR6, ADDR7, ADDR8, ADDR9, ADDR10, ADDR11, ADDR12, ADDR13, ADDR14, ADDR15, ADDR16, ADDR17, ADDR18, ADDR19, ADDR20, ADDR21, ADDR[0..21], DATA0, DATA1, DATA2, DATA3, DATA4, DATA5, DATA6, DATA7, DATA8, DATA9, DATA10, DATA11, DATA12, DATA13, DATA14, DATA15, DATA[0..15]
net class MCU_ETM: (no net found under the mark)
net class MCU_DMM: (no net found under the mark)

### Notes on the sheet
- Fraunhofer IISB
- Schottkystr. 10
- developed by:
- 91058 Erlangen
- Germany
- Author
- Project
- License
- Description
- File
- Version
- Release Date
- Sheet
- foxbms.org <https://foxbms.org>
- www.iisb.fraunhofer.de <https://www.iisb.fraunhofer.de/>
- foxBMS Team
- /

## Sheet mcu-adc.SchDoc
size A3; DocumentNumber: 23; SheetNumber: 23; SheetTotal: 45; SheetDescription: MCU ADC
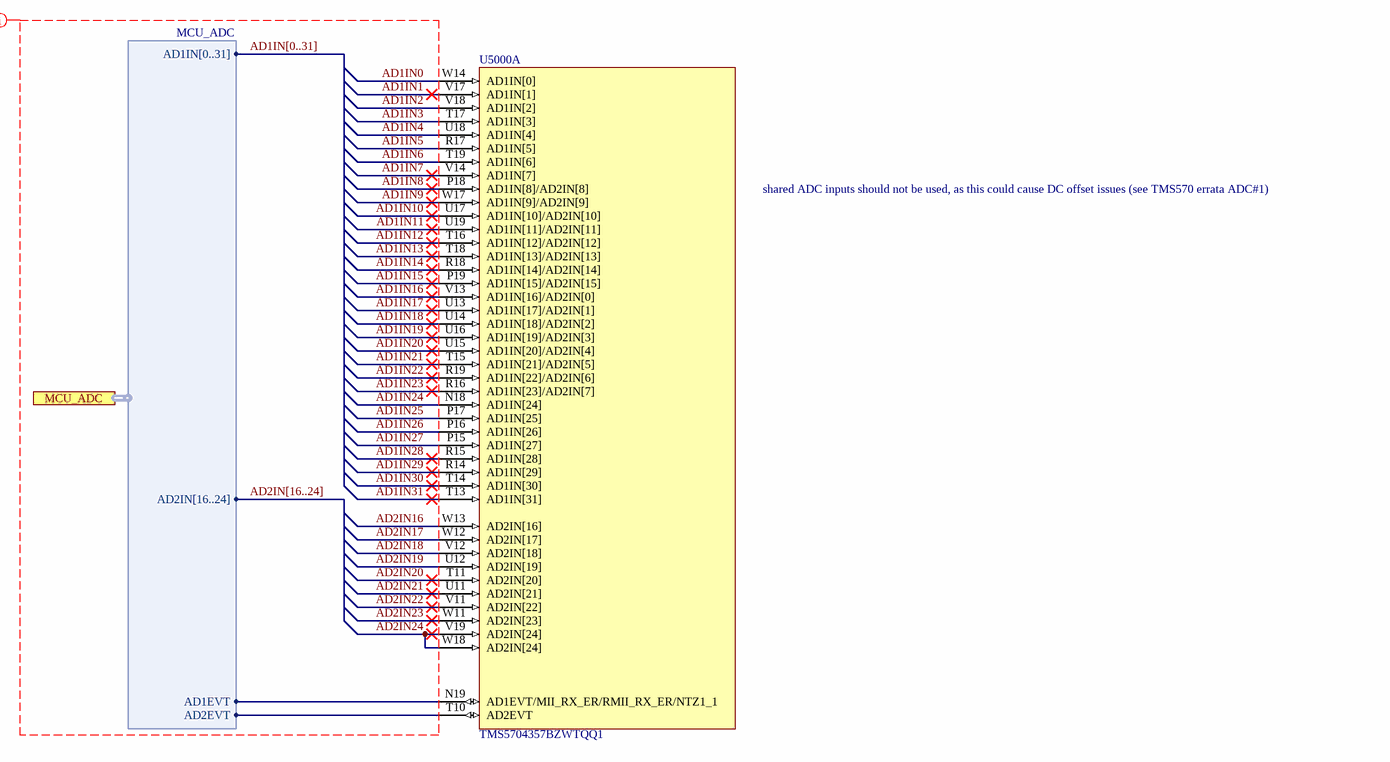
[diagram p9: mcu-adc.SchDoc]

### Parts
U5000  TMS5704357BZWTQQ1  [BGA337C80P19X19_1600X1600X140]  (part A of 6)

### Ports
MCU_ADC (harness MCU_ADC)

### Harnesses
MCU_ADC: AD2IN[16..24], AD1EVT, AD2EVT, AD1IN[0..31]

### Nets
AD1IN0: U5000.W14(AD1IN[0])  [project net SUPPLY_IO.SBC_MCU_ADC]
AD1IN1: U5000.V17(AD1IN[1])  [project net AD1IN1_21]
AD1IN2: U5000.V18(AD1IN[2])  [project net INTERLOCK_IO.IL_HS_VS]
AD1IN3: U5000.T17(AD1IN[3])  [project net INTERLOCK_IO.IL_LS_VS]
AD1IN4: U5000.U18(AD1IN[4])  [project net INTERLOCK_IO.IL_HS_CS]
AD1IN5: U5000.R17(AD1IN[5])  [project net INTERLOCK_IO.IL_LS_CS]
AD1IN6: U5000.T19(AD1IN[6])  [project net SUPPLY_IO.VSUP_30C_SENSE]
AD1IN7: U5000.V14(AD1IN[7])  [project net AD1IN7_21]
AD1IN8: U5000.P18(AD1IN[8]/AD2IN[8])  [project net AD1IN8_21]
AD1IN9: U5000.W17(AD1IN[9]/AD2IN[9])  [project net AD1IN9_21]
AD1IN10: U5000.U17(AD1IN[10]/AD2IN[10])  [project net AD1IN10_21]
AD1IN11: U5000.U19(AD1IN[11]/AD2IN[11])  [project net AD1IN11_21]
AD1IN12: U5000.T16(AD1IN[12]/AD2IN[12])  [project net AD1IN12_21]
AD1IN13: U5000.T18(AD1IN[13]/AD2IN[13])  [project net AD1IN13_21]
AD1IN14: U5000.R18(AD1IN[14]/AD2IN[14])  [project net AD1IN14_21]
AD1IN15: U5000.P19(AD1IN[15]/AD2IN[15])  [project net AD1IN15_21]
AD1IN16: U5000.V13(AD1IN[16]/AD2IN[0])  [project net AD1IN16_21]
AD1IN17: U5000.U13(AD1IN[17]/AD2IN[1])  [project net AD1IN17_21]
AD1IN18: U5000.U14(AD1IN[18]/AD2IN[2])  [project net AD1IN18_21]
AD1IN19: U5000.U16(AD1IN[19]/AD2IN[3])  [project net AD1IN19_21]
AD1IN20: U5000.U15(AD1IN[20]/AD2IN[4])  [project net AD1IN20_21]
AD1IN21: U5000.T15(AD1IN[21]/AD2IN[5])  [project net AD1IN21_21]
AD1IN22: U5000.R19(AD1IN[22]/AD2IN[6])  [project net AD1IN22_21]
AD1IN23: U5000.R16(AD1IN[23]/AD2IN[7])  [project net AD1IN23_21]
AD1IN24: U5000.N18(AD1IN[24])
AD1IN25: U5000.P17(AD1IN[25])
AD1IN26: U5000.P16(AD1IN[26])
AD1IN27: U5000.P15(AD1IN[27])
AD1IN28: U5000.R15(AD1IN[28])  [project net AD1IN28_21]
AD1IN29: U5000.R14(AD1IN[29])  [project net AD1IN29_21]
AD1IN30: U5000.T14(AD1IN[30])  [project net AD1IN30_21]
AD1IN31: U5000.T13(AD1IN[31])  [project net AD1IN31_21]
AD2IN16: U5000.W13(AD2IN[16])
AD2IN17: U5000.W12(AD2IN[17])
AD2IN18: U5000.V12(AD2IN[18])
AD2IN19: U5000.U12(AD2IN[19])
AD2IN20: U5000.T11(AD2IN[20])  [project net AD2IN20_21]
AD2IN21: U5000.U11(AD2IN[21])  [project net AD2IN21_21]
AD2IN22: U5000.V11(AD2IN[22])  [project net AD2IN22_21]
AD2IN23: U5000.W11(AD2IN[23])  [project net AD2IN23_21]
AD2IN24: U5000.V19(AD2IN[24]) U5000.W18(AD2IN[24])  [project net AD2IN24_21]
EXT_CON.AD1EVT: U5000.N19(AD1EVT/MII_RX_ER/RMII_RX_ER/NTZ1_1) ; port MCU_ADC.AD1EVT
EXT_CON.AD2EVT: U5000.T10(AD2EVT) ; port MCU_ADC.AD2EVT

### Buses and harness runs
bus AD1IN[0..31]
bus AD2IN[16..24]

### Layout directives
net class MCU_ADC: AD1IN0, AD1IN1, AD1IN2, AD1IN3, AD1IN4, AD1IN5, AD1IN6, AD1IN7, AD1IN8, AD1IN9, AD1IN10, AD1IN11, AD1IN12, AD1IN13, AD1IN14, AD1IN15, AD1IN16, AD1IN17, AD1IN18, AD1IN19, AD1IN20, AD1IN21, AD1IN22, AD1IN23, AD1IN24, AD1IN25, AD1IN26, AD1IN27, AD1IN28, AD1IN29, AD1IN30, AD1IN31, AD1IN[0..31], AD2IN16, AD2IN17, AD2IN18, AD2IN19, AD2IN20, AD2IN21, AD2IN22, AD2IN23, AD2IN24, AD2IN[16..24]

### Notes on the sheet
- shared ADC inputs should not be used, as this could cause DC offset issues (see TMS570 errata ADC#1)
- Fraunhofer IISB
- Schottkystr. 10
- developed by:
- 91058 Erlangen
- Germany
- Author
- Project
- License
- Description
- File
- Version
- Release Date
- Sheet
- foxbms.org <https://foxbms.org>
- www.iisb.fraunhofer.de <https://www.iisb.fraunhofer.de/>
- foxBMS Team
- /

## Sheet connectors-external.SchDoc
size A3
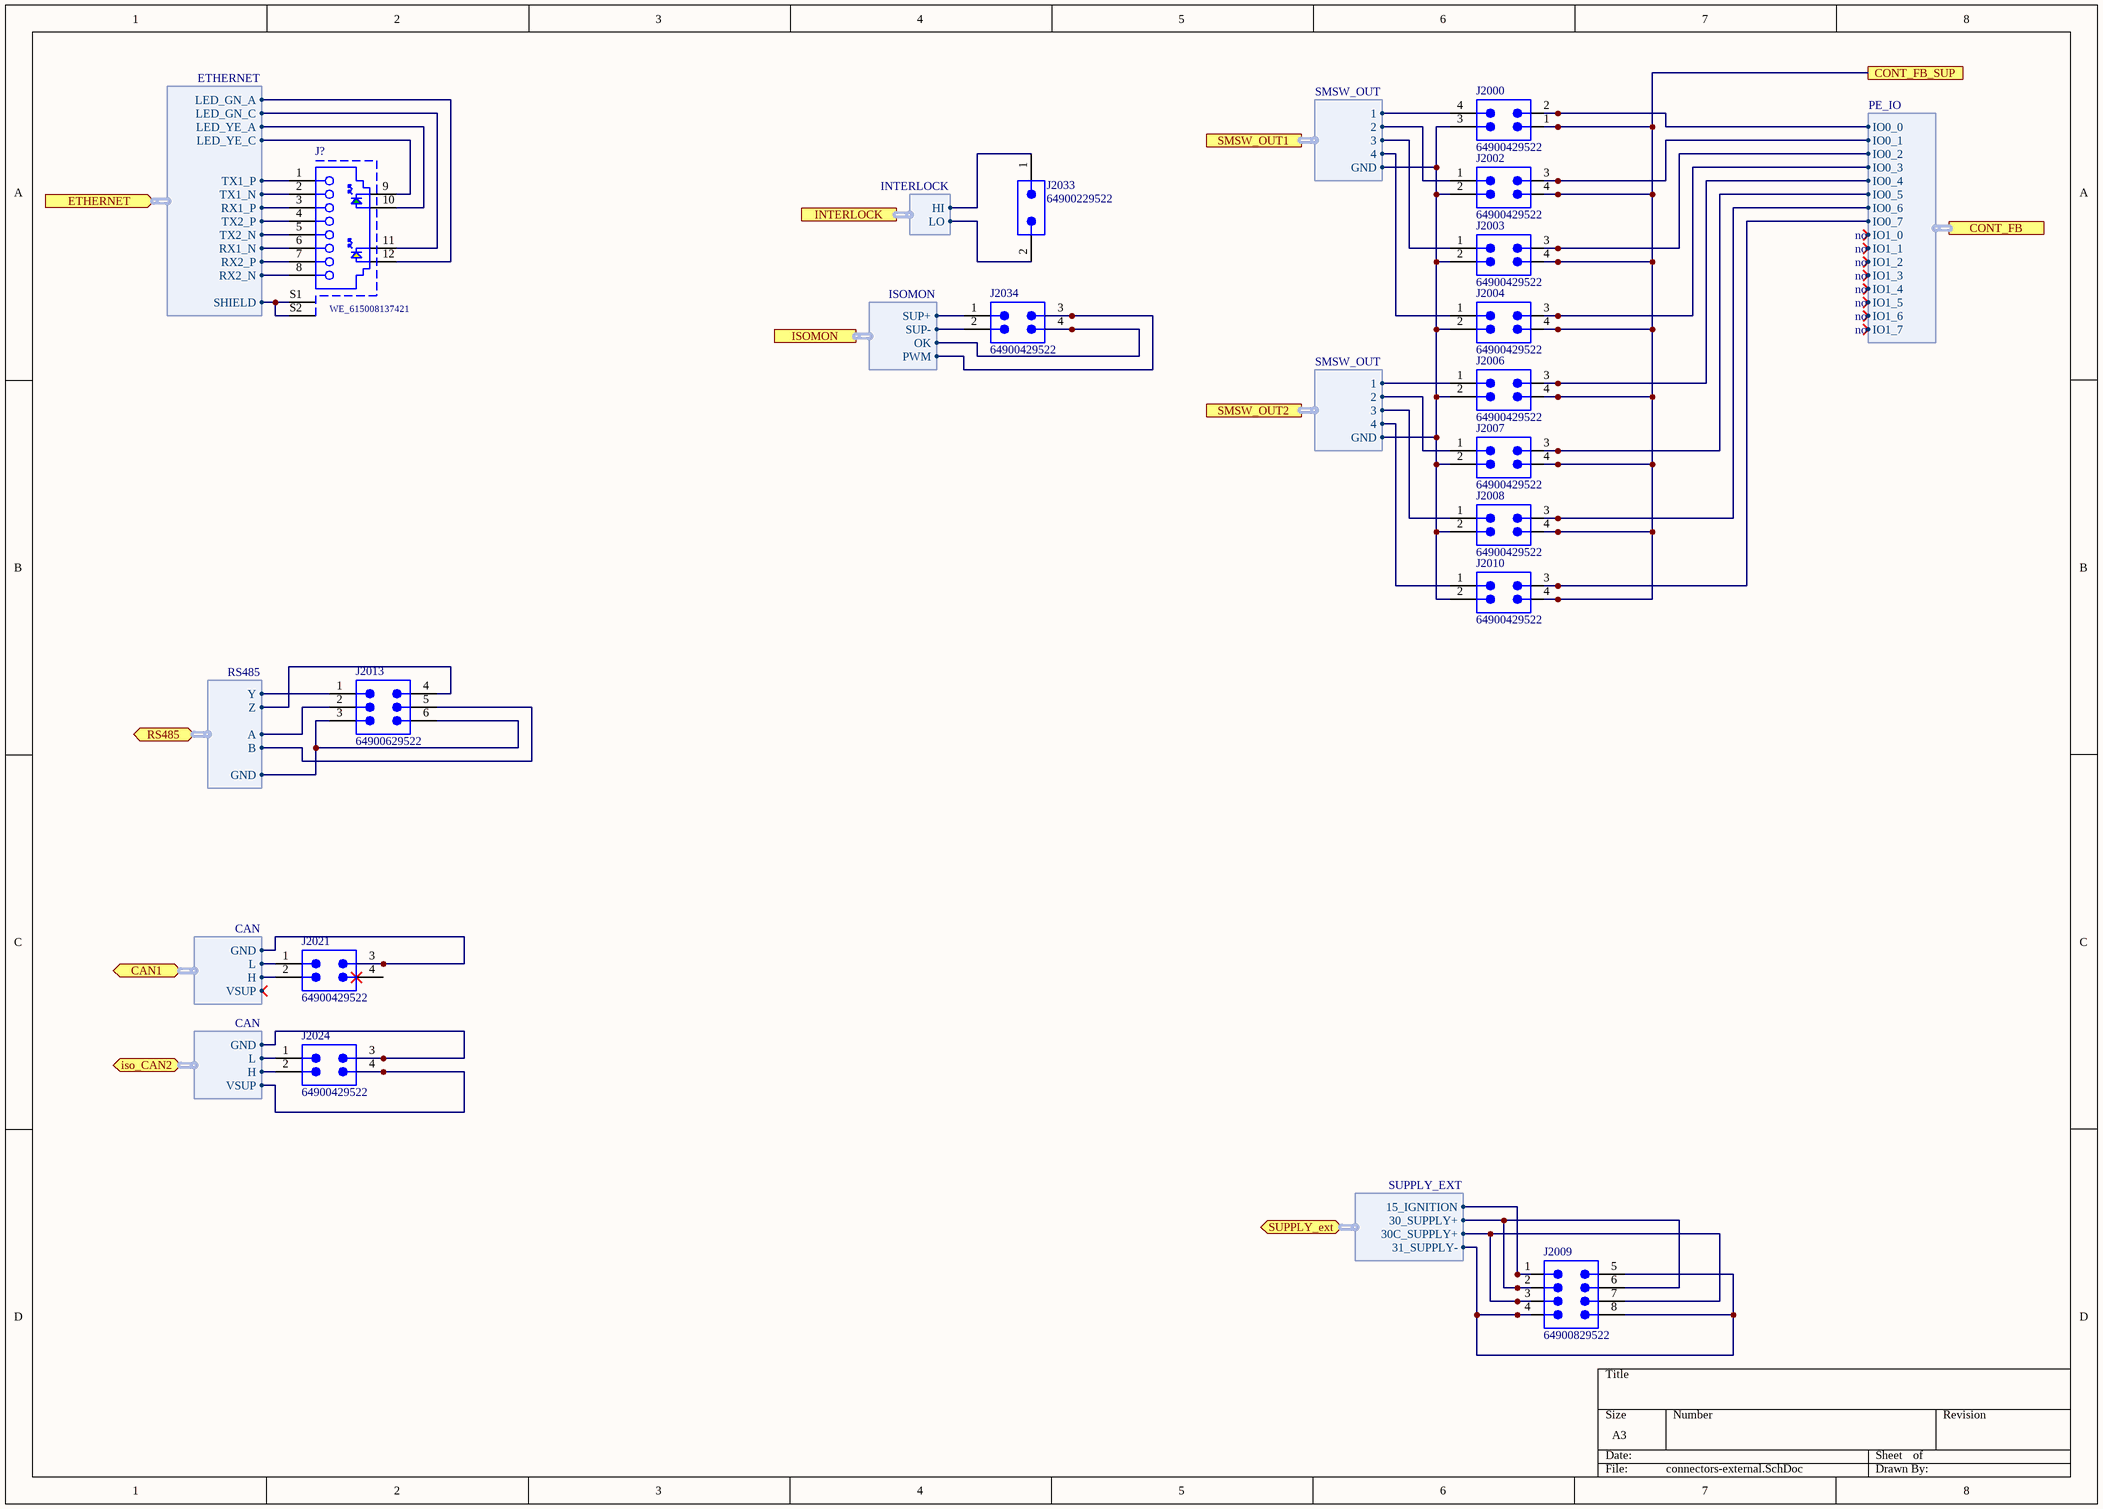
[diagram p10: connectors-external.SchDoc]

### Parts
(Parts that share a designator on the sheet are numbered #1, #2 ... from top to bottom, then left to right.)
J2000#2  64900429522  [64900429522]
J2002#2  64900429522  [64900429522]
J2003#2  64900429522  [64900429522]
J2004#2  64900429522  [64900429522]
J2006#2  64900429522  [64900429522]
J2007#2  64900429522  [64900429522]
J2008#2  64900429522  [64900429522]
J2009#2  64900829522  [64900829522]
J2010#2  64900429522  [64900429522]
J2013#2  64900629522  [64900629522]
J2021#2  64900429522  [64900429522]
J2024#2  64900429522  [64900429522]
J2033#2  64900229522  [64900229522]
J2034#2  64900429522  [64900429522]
J?  WE_615008137421  [WE_615008137421]

### Ports
CAN1 (bidir, harness CAN), CONT_FB (harness PE_IO), CONT_FB_SUP, ETHERNET (in, harness ETHERNET), INTERLOCK (harness INTERLOCK), iso_CAN2 (bidir, harness CAN), ISOMON (harness ISOMON), RS485 (bidir, harness RS485), SMSW_OUT1 (harness SMSW_OUT), SMSW_OUT2 (harness SMSW_OUT), SUPPLY_ext (bidir, harness SUPPLY_EXT)

### Harnesses
RS485: Y, Z, A, B, GND
SMSW_OUT: 1, 2, 3, 4, GND
PE_IO: IO0_0, IO0_1, IO0_2, IO0_3, IO0_4, IO0_5, IO0_6, IO0_7, IO1_0, IO1_1, IO1_2, IO1_3, IO1_4, IO1_5, IO1_6, IO1_7
ISOMON: SUP+, SUP-, OK, PWM
CAN: H, L, GND, VSUP
INTERLOCK: HI, LO
ETHERNET: TX1_P, TX1_N, RX1_P, TX2_P, TX2_N, RX1_N, RX2_P, RX2_N, SHIELD, LED_YE_C, LED_YE_A, LED_GN_C, LED_GN_A
SUPPLY_EXT: 30_SUPPLY+, 31_SUPPLY-, 15_IGNITION, 30C_SUPPLY+

### Nets
GND: J2009#2.4 J2009#2.5 J2009#2.8 ; port SUPPLY_ext.31_SUPPLY-
VBB_12V: J2000#2.1 J2002#2.4 J2003#2.4 J2004#2.4 J2006#2.4 J2007#2.4 J2008#2.4 J2010#2.4 ; port CONT_FB_SUP
CAN1.GND: J2021#2.3 ; port CAN1.GND
CAN1.H: J2021#2.2 ; port CAN1.H
CAN1.L: J2021#2.1 ; port CAN1.L
CONT_FB.IO0_0: J2000#2.2 ; port CONT_FB.IO0_0
CONT_FB.IO0_1: J2002#2.3 ; port CONT_FB.IO0_1
CONT_FB.IO0_2: J2003#2.3 ; port CONT_FB.IO0_2
CONT_FB.IO0_3: J2004#2.3 ; port CONT_FB.IO0_3
CONT_FB.IO0_4: J2006#2.3 ; port CONT_FB.IO0_4
CONT_FB.IO0_5: J2007#2.3 ; port CONT_FB.IO0_5
CONT_FB.IO0_6: J2008#2.3 ; port CONT_FB.IO0_6
CONT_FB.IO0_7: J2010#2.3 ; port CONT_FB.IO0_7
ETHERNET.LED_GN_A: J?.12 ; port ETHERNET.LED_GN_A
ETHERNET.LED_GN_C: J?.11 ; port ETHERNET.LED_GN_C
ETHERNET.LED_YE_A: J?.10 ; port ETHERNET.LED_YE_A
ETHERNET.LED_YE_C: J?.9 ; port ETHERNET.LED_YE_C
ETHERNET.RX1_N: J?.6 ; port ETHERNET.RX1_N
ETHERNET.RX1_P: J?.3 ; port ETHERNET.RX1_P
ETHERNET.RX2_N: J?.8 ; port ETHERNET.RX2_N
ETHERNET.RX2_P: J?.7 ; port ETHERNET.RX2_P
ETHERNET.SHIELD: J?.S1 J?.S2 ; port ETHERNET.SHIELD
ETHERNET.TX1_N: J?.2 ; port ETHERNET.TX1_N
ETHERNET.TX1_P: J?.1 ; port ETHERNET.TX1_P
ETHERNET.TX2_N: J?.5 ; port ETHERNET.TX2_N
ETHERNET.TX2_P: J?.4 ; port ETHERNET.TX2_P
INTERLOCK.HI: J2033#2.1 ; port INTERLOCK.HI
INTERLOCK.LO: J2033#2.2 ; port INTERLOCK.LO
iso_CAN2.GND: J2024#2.3 ; port iso_CAN2.GND
iso_CAN2.H: J2024#2.2 ; port iso_CAN2.H
iso_CAN2.L: J2024#2.1 ; port iso_CAN2.L
iso_CAN2.VSUP: J2024#2.4 ; port iso_CAN2.VSUP
ISOMON.OK: J2034#2.4 ; port ISOMON.OK
ISOMON.PWM: J2034#2.3 ; port ISOMON.PWM
ISOMON.SUP+: J2034#2.1 ; port ISOMON.SUP+
ISOMON.SUP-: J2034#2.2 ; port ISOMON.SUP-
RS485.A: J2013#2.2 ; port RS485.A
RS485.B: J2013#2.5 ; port RS485.B
RS485.GND: J2013#2.3 J2013#2.6 ; port RS485.GND
RS485.Y: J2013#2.1 ; port RS485.Y
RS485.Z: J2013#2.4 ; port RS485.Z
SMSW_OUT1.1: J2000#2.4 ; port SMSW_OUT1.1
SMSW_OUT1.2: J2002#2.1 ; port SMSW_OUT1.2
SMSW_OUT1.3: J2003#2.1 ; port SMSW_OUT1.3
SMSW_OUT1.4: J2004#2.1 ; port SMSW_OUT1.4
SMSW_OUT1.GND: J2000#2.3 J2002#2.2 J2003#2.2 J2004#2.2 J2006#2.2 J2007#2.2 J2008#2.2 J2010#2.2 ; port SMSW_OUT1.GND, port SMSW_OUT2.GND
SMSW_OUT2.1: J2006#2.1 ; port SMSW_OUT2.1
SMSW_OUT2.2: J2007#2.1 ; port SMSW_OUT2.2
SMSW_OUT2.3: J2008#2.1 ; port SMSW_OUT2.3
SMSW_OUT2.4: J2010#2.1 ; port SMSW_OUT2.4
SUPPLY_ext.15_IGNITION: J2009#2.1 ; port SUPPLY_ext.15_IGNITION
SUPPLY_ext.30_SUPPLY+: J2009#2.2 J2009#2.6 ; port SUPPLY_ext.30_SUPPLY+
SUPPLY_ext.30C_SUPPLY+: J2009#2.3 J2009#2.7 ; port SUPPLY_ext.30C_SUPPLY+

Not connected (* = marked no-connect by the designer): J2021#2 4

### Notes on the sheet
- not used

### Library data of the parts
J2000#2 J2002#2 J2003#2 J2004#2 J2006#2 J2007#2 J2008#2 J2010#2 J2021#2 J2024#2 J2034#2 = CMP-1502-00518-2: NexarPartId: 8917584; Insulation Resistance: 1GΩ; Connector Type: Male Pin, Socket; Gender: Male; Number of Positions: 4; Contact Resistance: 10mΩ; Insulation: Insulated; Operating Supply Voltage: 600V; Pitch: 4.2mm; Row Spacing: 5.5118mm; Current Rating: 8A; Height: 12.8mm; Contact Gender: Male; Color: White; Length: 9.6mm; Mount: Through Hole; Width: 9.6mm; Termination: Through Hole; Flammability Rating: UL94 V-0; Number of Pins: 4; Contact Material: Copper; REACH SVHC: Unknown; Lead Pitch: 4.2mm; Number of Rows: 2; RoHS: Compliant; Min Operating Temperature: -40°C; Housing Material: Nylon; Fastening Type: Ramp; Max Operating Temperature: 105°C; Voltage Rating: 600V; Contact Plating: Tin; Number of Contacts: 4
J2009#2 = CMP-1502-00520-2: NexarPartId: 8917586; Operating Supply Voltage: 600V; Lead Length: 3.6mm; Current Rating: 7A; Connector Type: Male Pin, Socket; Number of Positions: 8; Row Spacing: 5.5118mm; Insulation Resistance: 1GΩ; Contact Resistance: 10mΩ; Pitch: 4.2mm; Gender: Male; Min Operating Temperature: -40°C; Height: 12.8mm; Lead Pitch: 4.2mm; Number of Rows: 2; Number of Pins: 8; Length: 18mm; Housing Material: Nylon; Mount: Through Hole; Color: White; RoHS: Compliant; Width: 18mm; Contact Gender: Male; Voltage Rating: 600V; Contact Material: Copper; Termination: Through Hole; Max Operating Temperature: 105°C; Flammability Rating: UL94 V-0; REACH SVHC: Unknown; Fastening Type: Ramp; Number of Contacts: 8; Contact Plating: Tin
J2013#2 = CMP-1502-00519-2: NexarPartId: 8917585; Operating Supply Voltage: 600V; Connector Type: Male Pin, Socket; Pitch: 4.2mm; Row Spacing: 5.5118mm; Insulation Resistance: 1GΩ; Gender: Male; Number of Contacts: 6; Insulation: Insulated; Contact Resistance: 10mΩ; Current Rating: 8A; Max Operating Temperature: 105°C; Contact Gender: Male; Length: 13.8mm; Fastening Type: Ramp; Mount: Through Hole; Flammability Rating: UL94 V-0; Termination: Through Hole; Lead Pitch: 4.2mm; Housing Material: Nylon; Color: White; Number of Rows: 2; Number of Pins: 6; Voltage Rating: 600V; RoHS: Compliant; Width: 13.8mm; Min Operating Temperature: -40°C; Height: 12.8mm; Contact Plating: Tin; Number of Positions: 6; Contact Material: Copper; REACH SVHC: Unknown
J2033#2 = CMP-1502-00517-2: NexarPartId: 8917583; Operating Supply Voltage: 600V; Connector Type: Male Pin, Socket; Gender: Male; Current Rating: 9A; Insulation: Insulated; Insulation Resistance: 1GΩ; Number of Positions: 2; Contact Resistance: 10mΩ; Row Spacing: 5.5118mm; Pitch: 4.2mm; Contact Material: Copper; RoHS: Compliant; Lead Pitch: 4.2mm; Min Operating Temperature: -40°C; Housing Material: Nylon; Width: 5.4mm; Color: White; Number of Pins: 2; Mount: Through Hole; Number of Rows: 2; Fastening Type: Ramp; Flammability Rating: UL94 V-0; Termination: Through Hole; Height: 12.8mm; Length: 5.4mm; Contact Plating: Tin; Contact Gender: Male; Number of Contacts: 2; Max Operating Temperature: 105°C; REACH SVHC: Unknown; Voltage Rating: 600V
J? = WE_615008137421: Modular Jack WR-MJ, Tab Up; Manufacturer: Würth; Pin Number: 8P8C; Port: 1x1; Entrance: Horizontal; Compliance: Lead free / RoHS; Rated Current: 1.5 A; Working Voltage: 125 VAC; Withstanding Voltage: 1000 VAC; Contact Resistance: 30 mOhm; Circuits: 12; Rated Voltage: 120V AC; Automotive Qualified: False; ComponentLink1Description: Datasheet; ComponentLink1URL: https://www.we-online.com/katalog/datasheet/615008137421.pdf; ComponentLink2Description: Datasheet; ComponentLink2URL: https://katalog.we-online.de/em/datasheet/615008185121.pdf; Part Number: WE_615008137421; Published Date: July 2018; Publisher: Wurth Elektronik; Operating Temperature: −40 °C - +85 °C; Mounting Technology: THT; Packaging: Tray; Part Name: WE_615008137421; Supplier 1: Mouser; Supplier Part Number 1: 710-615008137421; Supplier 3: Wuerth Electronics; Supplier Part Number 3: 615008137421; ECCN: EAR99

## Sheet connectors-internal.SchDoc
size A3; DocumentNumber: 13; SheetNumber: 13; SheetTotal: 45; SheetDescription: Connectors (internal)
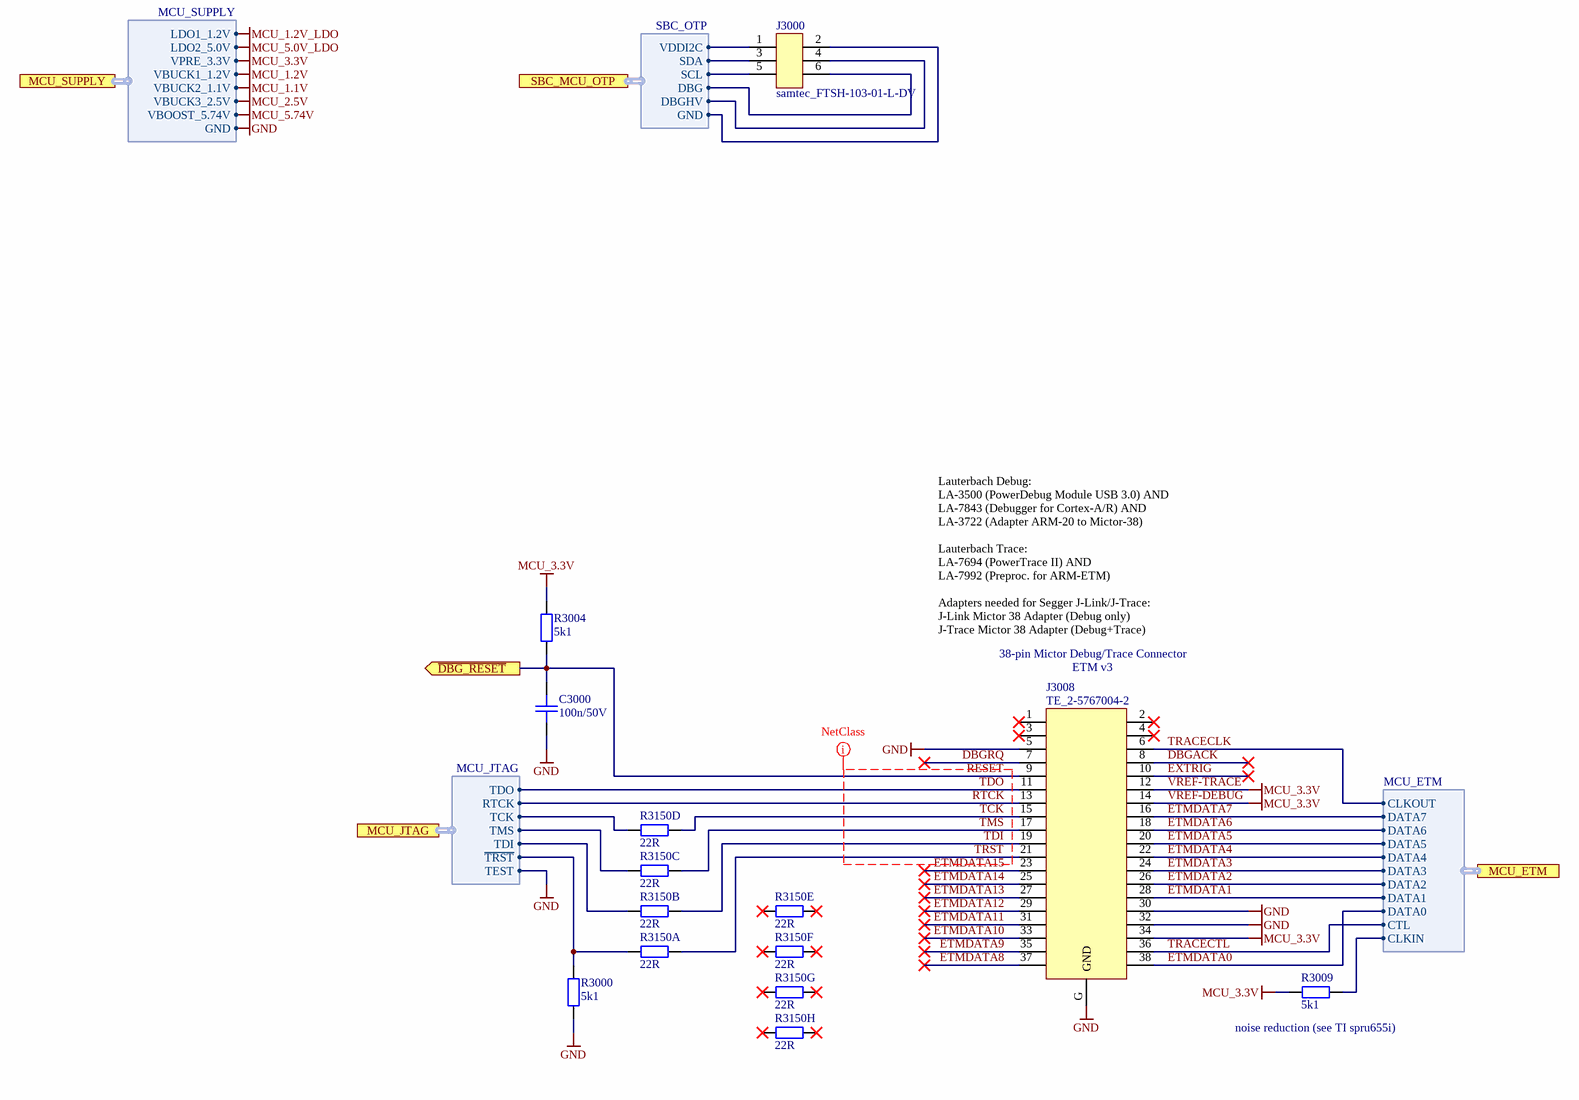
[diagram p11: connectors-internal.SchDoc]

### Parts
C3000  100n/50V  [CAPC1005X06N]
J3000  samtec_FTSH-103-01-L-DV  [SAMTEC_FTSH-103-01-L-DV]
J3008  TE_2-5767004-2  [TE_2-5767004-2]
R3000  5k1  [RESC1005X04N]
R3004  5k1  [RESC1005X04N]
R3009  5k1  [RESC1005X04N]
R3150  22R  [PANASONIC_EXB2HV]  (parts A,B,C,D,E,F,G,H of 8)

### Ports
MCU_ETM (harness MCU_ETM), MCU_JTAG (harness MCU_JTAG), MCU_SUPPLY (harness MCU_SUPPLY), SBC_MCU_OTP (harness SBC_OTP), ~{DBG_RESET} (out)

### Harnesses
SBC_OTP: VDDI2C, SDA, SCL, GND, DBG, DBGHV
MCU_SUPPLY: VBUCK1_1.2V, VBUCK2_1.1V, VBUCK3_2.5V, LDO1_1.2V, LDO2_5.0V, GND, VPRE_3.3V, VBOOST_5.74V
MCU_ETM: CLKOUT, CTL, CLKIN, DATA0, DATA1, DATA2, DATA3, DATA4, DATA5, DATA6, DATA7
MCU_JTAG: ~{TRST}, RTCK, TCK, TDI, TDO, TMS, TEST

### Nets
GND: C3000.1 J3000.2 J3008.5 J3008.30 J3008.32 J3008.G(GND) R3000.1 ; port SBC_MCU_OTP.GND, port MCU_SUPPLY.GND, port MCU_JTAG.TEST
MCU_3.3V: J3000.1 J3008.12 J3008.14 J3008.34 R3004.2 R3009.2 ; port SBC_MCU_OTP.VDDI2C, port MCU_SUPPLY.VPRE_3.3V  [also labelled VREF-DEBUG, VREF-TRACE]
~{RESET}: C3000.2 J3008.9 R3004.1 ; port ~{DBG_RESET}  [project net ~{DBG_RESET}]
~{TRST}: J3008.21 R3150.16  [project net ~{TRST_13}]
DBGACK: J3008.8  [project net DBGACK_13]
DBGRQ: J3008.7  [project net DBGRQ_13]
ETMDATA0: J3008.38 ; port MCU_ETM.DATA0  [project net MCU_ETM.DATA0]
ETMDATA1: J3008.28 ; port MCU_ETM.DATA1  [project net MCU_ETM.DATA1]
ETMDATA2: J3008.26 ; port MCU_ETM.DATA2  [project net MCU_ETM.DATA2]
ETMDATA3: J3008.24 ; port MCU_ETM.DATA3  [project net MCU_ETM.DATA3]
ETMDATA4: J3008.22 ; port MCU_ETM.DATA4  [project net MCU_ETM.DATA4]
ETMDATA5: J3008.20 ; port MCU_ETM.DATA5  [project net MCU_ETM.DATA5]
ETMDATA6: J3008.18 ; port MCU_ETM.DATA6  [project net MCU_ETM.DATA6]
ETMDATA7: J3008.16 ; port MCU_ETM.DATA7  [project net MCU_ETM.DATA7]
ETMDATA8: J3008.37  [project net ETMDATA8_13]
ETMDATA9: J3008.35  [project net ETMDATA9_13]
ETMDATA10: J3008.33  [project net ETMDATA10_13]
ETMDATA11: J3008.31  [project net ETMDATA11_13]
ETMDATA12: J3008.29  [project net ETMDATA12_13]
ETMDATA13: J3008.27  [project net ETMDATA13_13]
ETMDATA14: J3008.25  [project net ETMDATA14_13]
ETMDATA15: J3008.23  [project net ETMDATA15_13]
EXTRIG: J3008.10  [project net EXTRIG_13]
MCU_ETM.CLKIN: R3009.1 ; port MCU_ETM.CLKIN
MCU_JTAG~{.}TRST: R3000.2 R3150.1 ; port MCU_JTAG.~{TRST}
MCU_JTAG.TCK: R3150.4 ; port MCU_JTAG.TCK
MCU_JTAG.TDI: R3150.2 ; port MCU_JTAG.TDI
MCU_JTAG.TMS: R3150.3 ; port MCU_JTAG.TMS
RTCK: J3008.13 ; port MCU_JTAG.RTCK  [project net MCU_JTAG.RTCK]
SBC_MCU_OTP.DBG: J3000.6 ; port SBC_MCU_OTP.DBG
SBC_MCU_OTP.DBGHV: J3000.4 ; port SBC_MCU_OTP.DBGHV
SBC_MCU_OTP.SCL: J3000.5 ; port SBC_MCU_OTP.SCL
SBC_MCU_OTP.SDA: J3000.3 ; port SBC_MCU_OTP.SDA
TCK: J3008.15 R3150.13  [project net TCK_13]
TDI: J3008.19 R3150.15  [project net TDI_13]
TDO: J3008.11 ; port MCU_JTAG.TDO  [project net MCU_JTAG.TDO]
TMS: J3008.17 R3150.14  [project net TMS_13]
TRACECLK: J3008.6 ; port MCU_ETM.CLKOUT  [project net MCU_ETM.CLKOUT]
TRACECTL: J3008.36 ; port MCU_ETM.CTL  [project net MCU_ETM.CTL]

Not connected (* = marked no-connect by the designer): J3008 1* 2* 3* 4*; R3150 5* 6* 7* 8* 9* 10* 11* 12*

### Layout directives
net class MCU_JTAG: RTCK, TCK, TDI, TDO, TMS, ~{RESET}, ~{TRST}

### Notes on the sheet
- Lauterbach Debug:
  LA-3500 (PowerDebug Module USB 3.0) AND
  LA-7843 (Debugger for Cortex-A/R) AND
  LA-3722	(Adapter ARM-20 to Mictor-38)
  Lauterbach Trace:
  LA-7694 (PowerTrace II) AND
  LA-7992 (Preproc. for ARM-ETM)
  Adapters needed for Segger J-Link/J-Trace:
  J-Link Mictor 38 Adapter (Debug only)
  J-Trace Mictor 38 Adapter (Debug+Trace)
- 38-pin Mictor Debug/Trace Connector
- (near J3008) ETM v3
- (near R3009) noise reduction (see TI spru655i)
- Fraunhofer IISB
- Schottkystr. 10
- developed by:
- 91058 Erlangen
- Germany
- Author
- Project
- License
- Description
- File
- Version
- Release Date
- Sheet
- foxbms.org <https://foxbms.org>
- www.iisb.fraunhofer.de <https://www.iisb.fraunhofer.de/>
- foxBMS Team
- /

### Library data of the parts
C3000 = gen_C_ceramic_100n_50V_X7R_0402: MLCC; Capacitance: 100n; Rated Voltage: 50V; Dielectric: X7R; Case EIA: 0402; Case Metric: 1005; PnP Package: 0402C; PnP Value: 100nF/50V/X7R; PnP equipped: x; Automotive Qualified: True; AEC-Q Norm: AEC-Q200; Part Number: gen_C_ceramic_100n_50V_X7R_0402; Supplier 1: Farnell; Supplier Part Number 1: 2210822; ECCN: EAR99
J3000 = samtec_FTSH-103-01-L-DV: Board-To-Board Connector, 6pin, 1.27mm; Manufacturer: Samtec; Circuits: 6; Rated Current: 3.4A; Automotive Qualified: False; Part Number: samtec_FTSH-103-01-L-DV; Part Name: FTSH-103-01-L-DV; Operating Temperature: -55°C - +125°C; ComponentLink1Description: Datasheet; ComponentLink1URL: http://www.farnell.com/datasheets/1992056.pdf; Supplier 1: Farnell; Supplier Part Number 1: 2415840; Supplier 2: Mouser; Supplier Part Number 2: 200-FTSH10301LDVTR; Supplier 3: Digikey; Supplier Part Number 3: SAM13920CT-ND
J3008 = TE_2-5767004-2: Connector, SMT, 38 POS, MICTOR; Manufacturer: TE; Circuits: 38; Rated Voltage: 30V AC; Rated Current: 11.5A; Automotive Qualified: False; Part Number: TE_2-5767004-2; Part Name: TE_2-5767004-2; Operating Temperature: −55 °C - +125 °C; ComponentLink1Description: Datasheet; ComponentLink1URL: https://www.te.com/deu-de/product-2-5767004-2.datasheet.pdf; Supplier 1: Mouser; Supplier Part Number 1: 571-2-5767004-2; Supplier 2: Farnell; Supplier Part Number 2: 1076633; Supplier 3: Digikey; Supplier Part Number 3: A32308-ND; ECCN: EAR99
R3000 R3004 R3009 = gen_R_5k1_0402: SMD Resistor 5k1 0402; Tolerance: 1%; Power: 0.063W; Case EIA: 0402; Case Metric: 1005; Maximum Working Voltage: 50V; PnP Package: 0402R; Automotive Qualified: True; PnP equipped: x; AEC-Q Norm: AEC-Q200; AEC-Q Grade: Grade 0; Part Number: gen_R_5k1_0402; Operating Temperature: -55°C - +155°C; Resistance: 5k1; Series: E24; PnP Value: 5k1; Supplier 1: Farnell; Supplier Part Number 1: 2302709; ECCN: EAR99
R3150 = EXB2HV220JV: SMD Resistor Array 0402 8x; Tolerance: 5%; Power: 63mW; Case EIA: EXB2HV; Maximum Working Voltage: 25V; Automotive Qualified: True; AEC-Q Norm: AEC-Q200; AEC-Q Grade: Grade 1; Part Number: EXB2HV220JV; Operating Temperature: -55°C - +155°C; Resistance: 22R; Series: E24, E96; Supplier 1: Farnell; Supplier Part Number 1: 2060065; Supplier 2: Mouser; Supplier Part Number 2: 667-EXB-2HV220JV; ECCN: EAR99

## Sheet communication.SchDoc
size A3; DocumentNumber: 2; SheetNumber: 2; SheetTotal: 45; SheetDescription: Communication
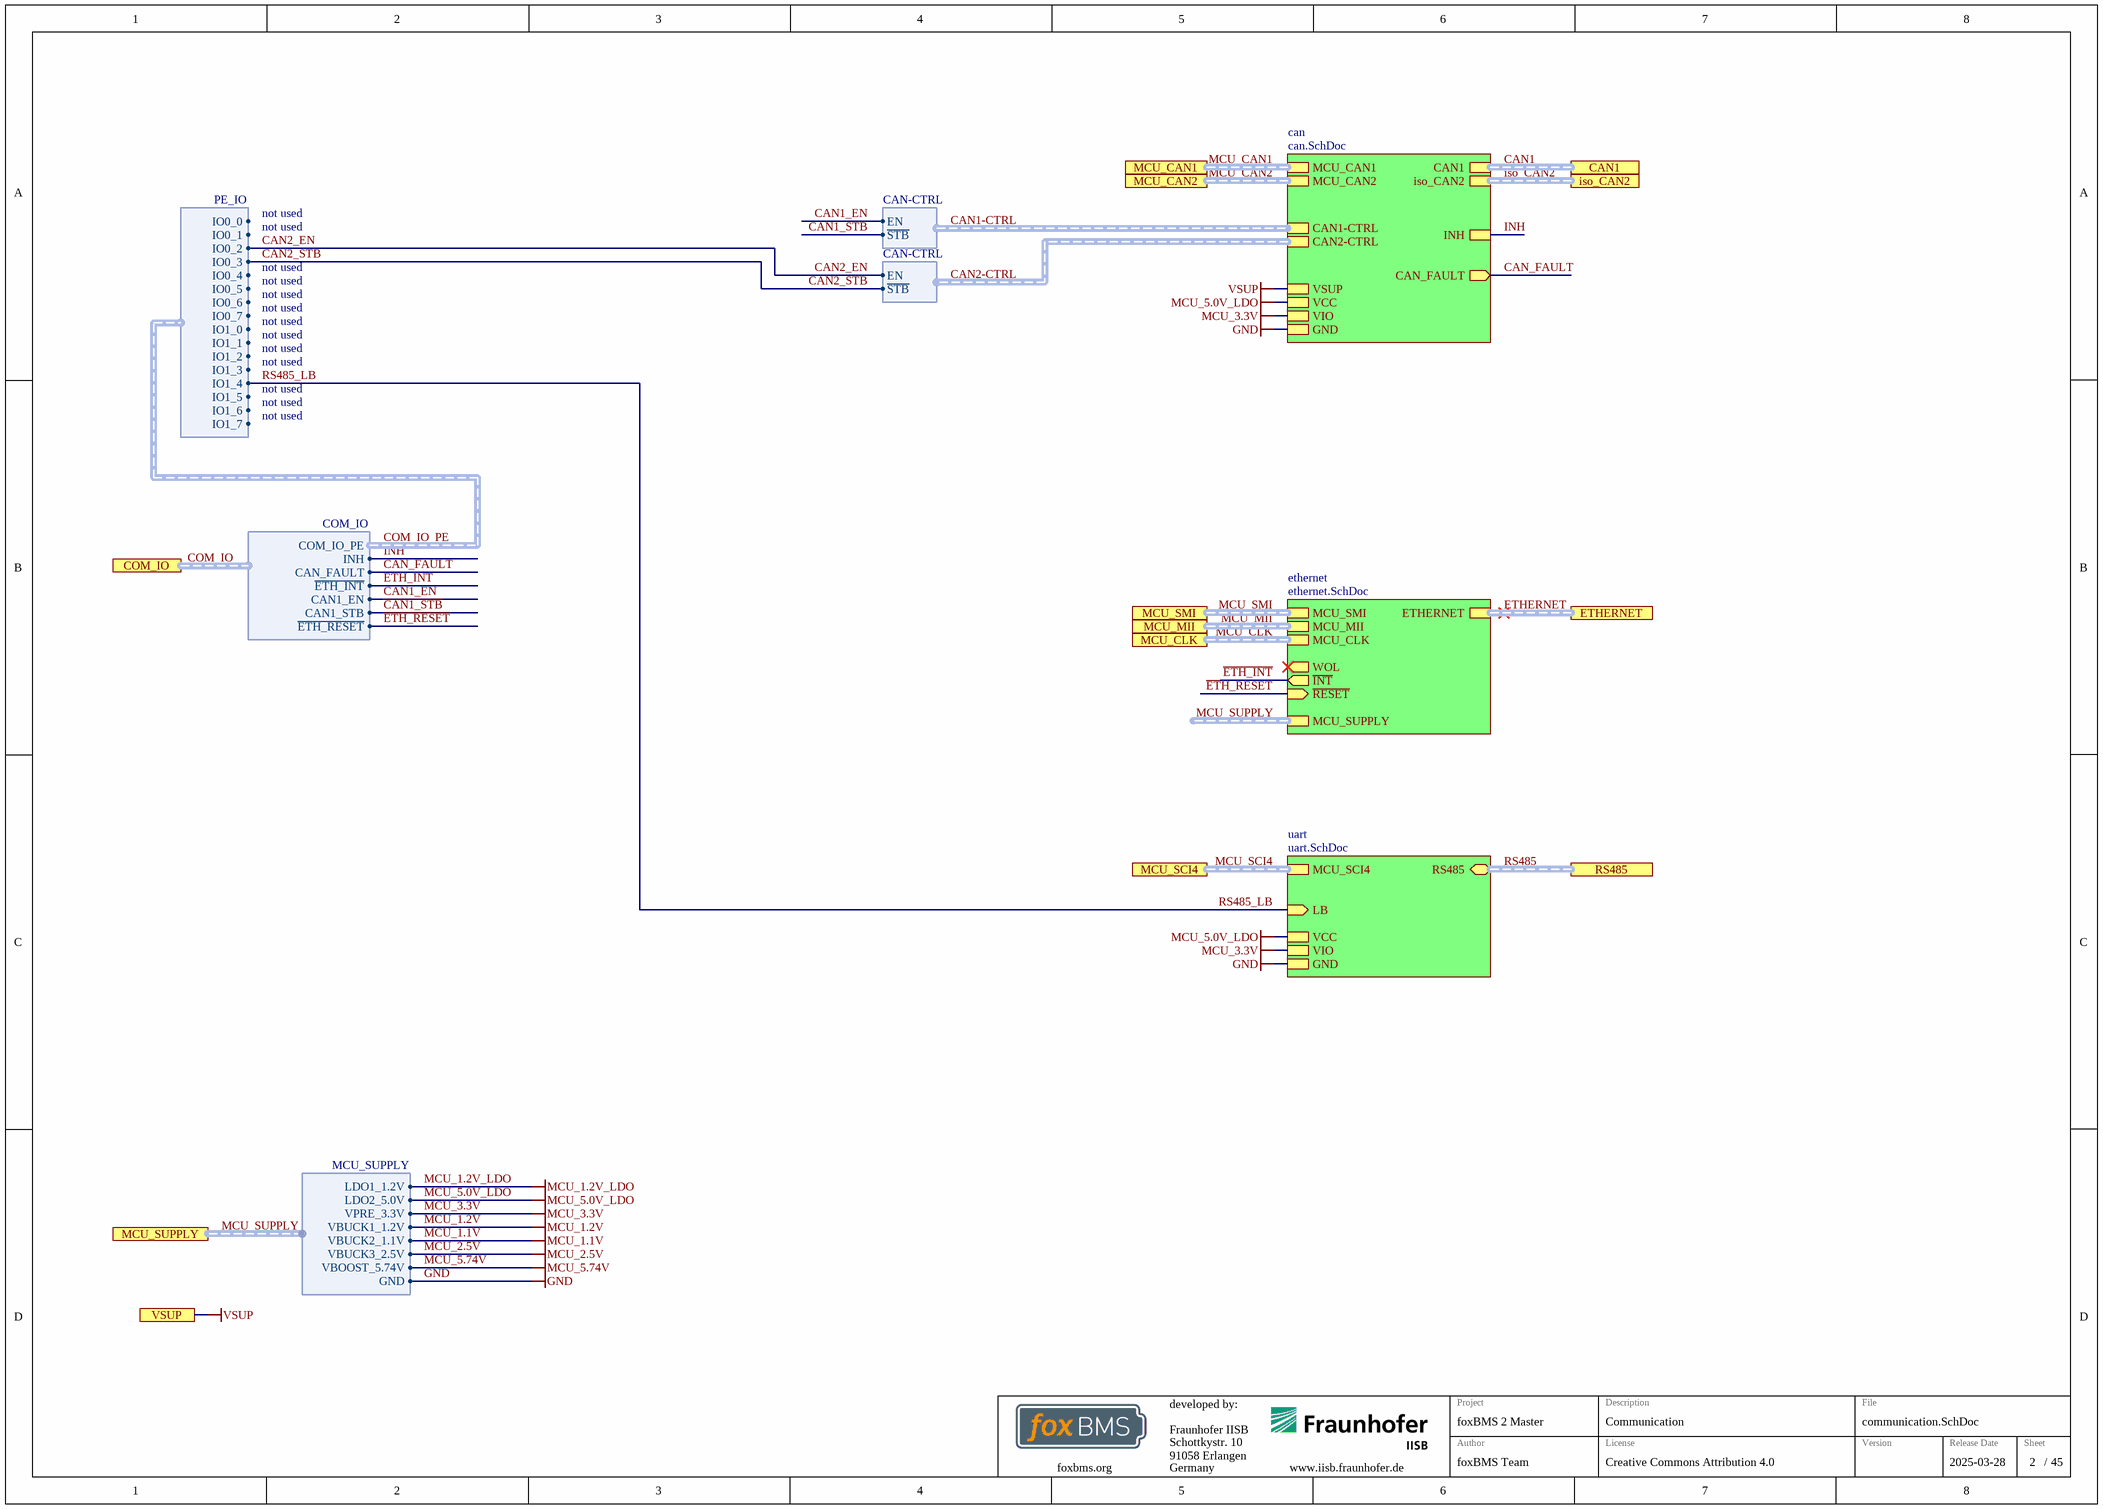
[diagram p12: communication.SchDoc]

### Sub-sheets
can = can.SchDoc (file not in this document): MCU_CAN1 (harness MCU_CAN), CAN2-CTRL (harness CAN-CTRL), CAN1-CTRL (harness CAN-CTRL), MCU_CAN2 (harness MCU_CAN), iso_CAN2 (harness CAN), CAN1 (harness CAN), VCC, GND, VSUP, INH, CAN_FAULT (out), VIO
ethernet = ethernet.SchDoc (file not in this document): MCU_SMI (harness MCU_SMI), WOL (out), MCU_MII (harness MCU_MII), ~{INT} (out), ~{RESET} (in), ETHERNET (harness ETHERNET), MCU_SUPPLY (harness MCU_SUPPLY), MCU_CLK (harness CLOCK)
uart = uart.SchDoc (file not in this document): MCU_SCI4 (harness MCU_SCI), LB (in), VIO, RS485 (bidir, harness RS485), VCC, GND

### Ports
CAN1 (harness CAN), COM_IO (harness COM_IO), ETHERNET (harness ETHERNET), iso_CAN2 (harness CAN), MCU_CAN1 (harness MCU_CAN), MCU_CAN2 (harness MCU_CAN), MCU_CLK (harness CLOCK), MCU_MII (harness MCU_MII), MCU_SCI4 (harness MCU_SCI), MCU_SMI (harness MCU_SMI), MCU_SUPPLY (harness MCU_SUPPLY), RS485 (harness RS485), VSUP

### Harnesses
PE_IO: IO0_0, IO0_1, IO0_2, IO0_3, IO0_4, IO0_5, IO0_6, IO0_7, IO1_0, IO1_1, IO1_2, IO1_3, IO1_4, IO1_5, IO1_6, IO1_7
CAN-CTRL: EN, ~{STB}
COM_IO: COM_IO_PE, CAN_FAULT, ~{ETH_INT}, INH, CAN1_EN, CAN1_STB, ~{ETH_RESET}
MCU_SUPPLY: VBUCK1_1.2V, VBUCK2_1.1V, VBUCK3_2.5V, LDO1_1.2V, LDO2_5.0V, GND, VPRE_3.3V, VBOOST_5.74V

### Nets
GND: sheet can/GND, sheet uart/GND, port MCU_SUPPLY.GND
MCU_3.3V: sheet can/VIO, sheet uart/VIO, port MCU_SUPPLY.VPRE_3.3V
MCU_5.0V_LDO: sheet can/VCC, sheet uart/VCC, port MCU_SUPPLY.LDO2_5.0V
VSUP: port VSUP, sheet can/VSUP  [project net VSUP_30]
~{CAN1_STB}: sheet can/CAN1-CTRL.~{STB}, port COM_IO.CAN1_STB  [project net CAN1-CTRL~{.}STB]
~{CAN2_STB}: harness PE_IO.IO0_3, sheet can/CAN2-CTRL.~{STB}  [project net CAN2-CTRL~{.}STB]
~{ETH_INT}: sheet ethernet/~{INT}, port COM_IO.~{ETH_INT}  [project net COM_IO~{.}ETH_INT]
~{ETH_RESET}: sheet ethernet/~{RESET}, port COM_IO.~{ETH_RESET}  [project net COM_IO~{.}ETH_RESET]
CAN1_EN: sheet can/CAN1-CTRL.EN, port COM_IO.CAN1_EN  [project net CAN1-CTRL.EN]
CAN2_EN: harness PE_IO.IO0_2, sheet can/CAN2-CTRL.EN  [project net CAN2-CTRL.EN]
CAN_FAULT: sheet can/CAN_FAULT, port COM_IO.CAN_FAULT  [project net COM_IO.CAN_FAULT]
INH: sheet can/INH, port COM_IO.INH  [project net COM_IO.INH]
RS485_LB: sheet uart/LB, harness PE_IO.IO1_4  [project net COM_IO_PE.IO1_4]

### Buses and harness runs
harness CAN1 = port CAN1 = sheet can/CAN1
harness CAN1-CTRL = sheet can/CAN1-CTRL
harness CAN2-CTRL = sheet can/CAN2-CTRL
harness COM_IO = port COM_IO
harness ETHERNET = port ETHERNET = sheet ethernet/ETHERNET
harness iso_CAN2 = port iso_CAN2 = sheet can/iso_CAN2
harness MCU_CAN1 = port MCU_CAN1 = sheet can/MCU_CAN1
harness MCU_CAN2 = port MCU_CAN2 = sheet can/MCU_CAN2
harness MCU_CLK = port MCU_CLK = sheet ethernet/MCU_CLK
harness MCU_MII = port MCU_MII = sheet ethernet/MCU_MII
harness MCU_SCI4 = port MCU_SCI4 = sheet uart/MCU_SCI4
harness MCU_SMI = port MCU_SMI = sheet ethernet/MCU_SMI
harness MCU_SUPPLY = port MCU_SUPPLY
harness MCU_SUPPLY = sheet ethernet/MCU_SUPPLY
harness RS485 = port RS485 = sheet uart/RS485

### Notes on the sheet
- not used
- Fraunhofer IISB
- Schottkystr. 10
- developed by:
- 91058 Erlangen
- Germany
- Author
- Project
- License
- Description
- File
- Version
- Release Date
- Sheet
- foxbms.org <https://foxbms.org>
- www.iisb.fraunhofer.de <https://www.iisb.fraunhofer.de/>
- foxBMS Team
- /

## Sheet peripherals.SchDoc
size A3; DocumentNumber: 28; SheetNumber: 28; SheetTotal: 45; SheetDescription: MCU Peripherals
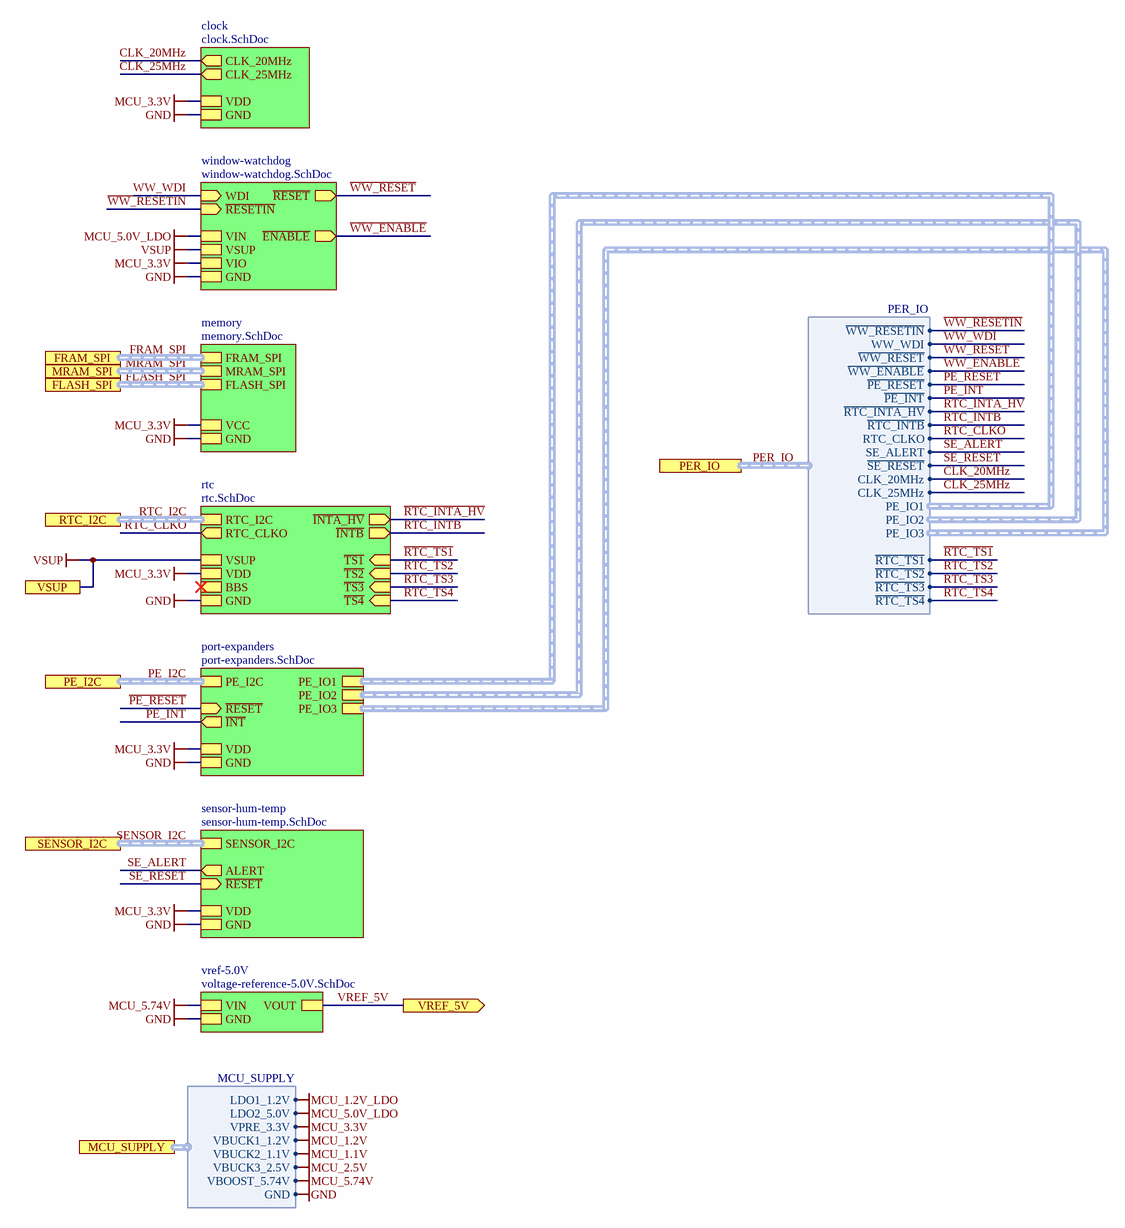
[diagram p13: peripherals.SchDoc]

### Sub-sheets
clock = clock.SchDoc (file not in this document): VDD, GND, CLK_20MHz (out), CLK_25MHz (out)
memory = memory.SchDoc (file not in this document): VCC, GND, FRAM_SPI (harness SPI), MRAM_SPI (harness SPI), FLASH_SPI (harness SPI)
port-expanders = port-expanders.SchDoc (file not in this document): PE_IO2 (harness PE_IO), PE_IO1 (harness PE_IO), GND, VDD, ~{RESET} (in), PE_I2C (harness I2C), ~{INT} (out), PE_IO3 (harness PE_IO)
rtc = rtc.SchDoc: RTC_I2C (harness I2C), ~{INTB} (out), ~{INTA_HV} (out), GND, VSUP, ~{TS4} (in), ~{TS3} (in), ~{TS2} (in), ~{TS1} (in), BBS, RTC_CLKO (out), VDD
sensor-hum-temp = sensor-hum-temp.SchDoc (file not in this document): GND, ~{RESET} (in), ALERT (out), VDD, SENSOR_I2C (harness I2C)
vref-5.0V = voltage-reference-5.0V.SchDoc (file not in this document): GND, VOUT, VIN
window-watchdog = window-watchdog.SchDoc: GND, VIO, ~{ENABLE} (out), ~{RESET} (out), WDI (in), VIN, ~{RESETIN} (in), VSUP

### Ports
FLASH_SPI (harness SPI), FRAM_SPI (harness SPI), MCU_SUPPLY (harness MCU_SUPPLY), MRAM_SPI (harness SPI), PE_I2C (harness I2C), PER_IO (harness PER_IO), RTC_I2C (harness I2C), SENSOR_I2C (harness I2C), VREF_5V (out), VSUP

### Harnesses
MCU_SUPPLY: VBUCK1_1.2V, VBUCK2_1.1V, VBUCK3_2.5V, LDO1_1.2V, LDO2_5.0V, GND, VPRE_3.3V, VBOOST_5.74V
PER_IO: WW_WDI, ~{WW_RESET}, ~{WW_ENABLE}, ~{PE_RESET}, ~{PE_INT}, ~{RTC_INTA_HV}, ~{RTC_INTB}, RTC_CLKO, SE_ALERT, ~{SE_RESET}, CLK_20MHz, CLK_25MHz, PE_IO1, PE_IO2, PE_IO3, ~{RTC_TS1}, ~{RTC_TS2}, ~{RTC_TS3}, ~{RTC_TS4}, ~{WW_RESETIN}

### Nets
GND: sheet clock/GND, sheet window-watchdog/GND, sheet memory/GND, sheet sensor-hum-temp/GND, sheet rtc/GND, sheet port-expanders/GND, sheet vref-5.0V/GND, port MCU_SUPPLY.GND
MCU_3.3V: sheet clock/VDD, sheet window-watchdog/VIO, sheet memory/VCC, sheet sensor-hum-temp/VDD, sheet rtc/VDD, sheet port-expanders/VDD, port MCU_SUPPLY.VPRE_3.3V
MCU_5.0V_LDO: sheet window-watchdog/VIN, port MCU_SUPPLY.LDO2_5.0V
MCU_5.74V: sheet vref-5.0V/VIN, port MCU_SUPPLY.VBOOST_5.74V
VREF_5V: port VREF_5V, sheet vref-5.0V/VOUT
VSUP: port VSUP, sheet window-watchdog/VSUP, sheet rtc/VSUP  [project net VSUP_30]
~{PE_INT}: sheet port-expanders/~{INT}, port PER_IO.~{PE_INT}  [project net MCU_GIOB.4]
~{PE_RESET}: sheet port-expanders/~{RESET}, port PER_IO.~{PE_RESET}  [project net MCU_GIOX.M4]
~{RTC_INTA_HV}: sheet rtc/~{INTA_HV}, port PER_IO.~{RTC_INTA_HV}  [project net PER_IO~{.}RTC_INTA_HV]
~{RTC_INTB}: sheet rtc/~{INTB}, port PER_IO.~{RTC_INTB}  [project net MCU_GIOB.1]
~{RTC_TS1}: sheet rtc/~{TS1}, port PER_IO.~{RTC_TS1}  [project net MCU_GIOX.D13]
~{RTC_TS2}: sheet rtc/~{TS2}, port PER_IO.~{RTC_TS2}  [project net MCU_GIOX.D12]
~{RTC_TS3}: sheet rtc/~{TS3}, port PER_IO.~{RTC_TS3}  [project net MCU_GIOX.D11]
~{RTC_TS4}: sheet rtc/~{TS4}, port PER_IO.~{RTC_TS4}  [project net MCU_GIOX.K16]
~{SE_RESET}: sheet sensor-hum-temp/~{RESET}, port PER_IO.~{SE_RESET}  [project net PE_IO3.IO0_0]
~{WW_ENABLE}: sheet window-watchdog/~{ENABLE}, port PER_IO.~{WW_ENABLE}  [project net EXT_CON~{.}WW_ENABLE]
~{WW_RESET}: sheet window-watchdog/~{RESET}, port PER_IO.~{WW_RESET}  [project net ~{DBG_RESET}]
~{WW_RESETIN}: sheet window-watchdog/~{RESETIN}, port PER_IO.~{WW_RESETIN}  [project net EXT_CON~{.}SBC_MCU_RESET]
CLK_20MHz: sheet clock/CLK_20MHz, port PER_IO.CLK_20MHz  [project net EXT_CON.ADC_CLK]
CLK_25MHz: sheet clock/CLK_25MHz, port PER_IO.CLK_25MHz  [project net MCU_CLK.25MHz]
RTC_CLKO: sheet rtc/RTC_CLKO, port PER_IO.RTC_CLKO  [project net MCU_DCC.2]
SE_ALERT: sheet sensor-hum-temp/ALERT, port PER_IO.SE_ALERT  [project net PE_IO3.IO0_1]
WW_WDI: sheet window-watchdog/WDI, port PER_IO.WW_WDI  [project net MCU_GIOX.K4]

### Buses and harness runs
harness FLASH_SPI = port FLASH_SPI = sheet memory/FLASH_SPI
harness FRAM_SPI = port FRAM_SPI = sheet memory/FRAM_SPI
harness MRAM_SPI = port MRAM_SPI = sheet memory/MRAM_SPI
harness PE_I2C = port PE_I2C = sheet port-expanders/PE_I2C
harness PER_IO = port PER_IO
harness RTC_I2C = port RTC_I2C = sheet rtc/RTC_I2C
harness SENSOR_I2C = port SENSOR_I2C = sheet sensor-hum-temp/SENSOR_I2C

### Notes on the sheet
- Fraunhofer IISB
- Schottkystr. 10
- developed by:
- 91058 Erlangen
- Germany
- Author
- Project
- License
- Description
- File
- Version
- Release Date
- Sheet
- foxbms.org <https://foxbms.org>
- www.iisb.fraunhofer.de <https://www.iisb.fraunhofer.de/>
- foxBMS Team
- /